# Altium project SW_balance.PrjPcb (part 1 of 2)
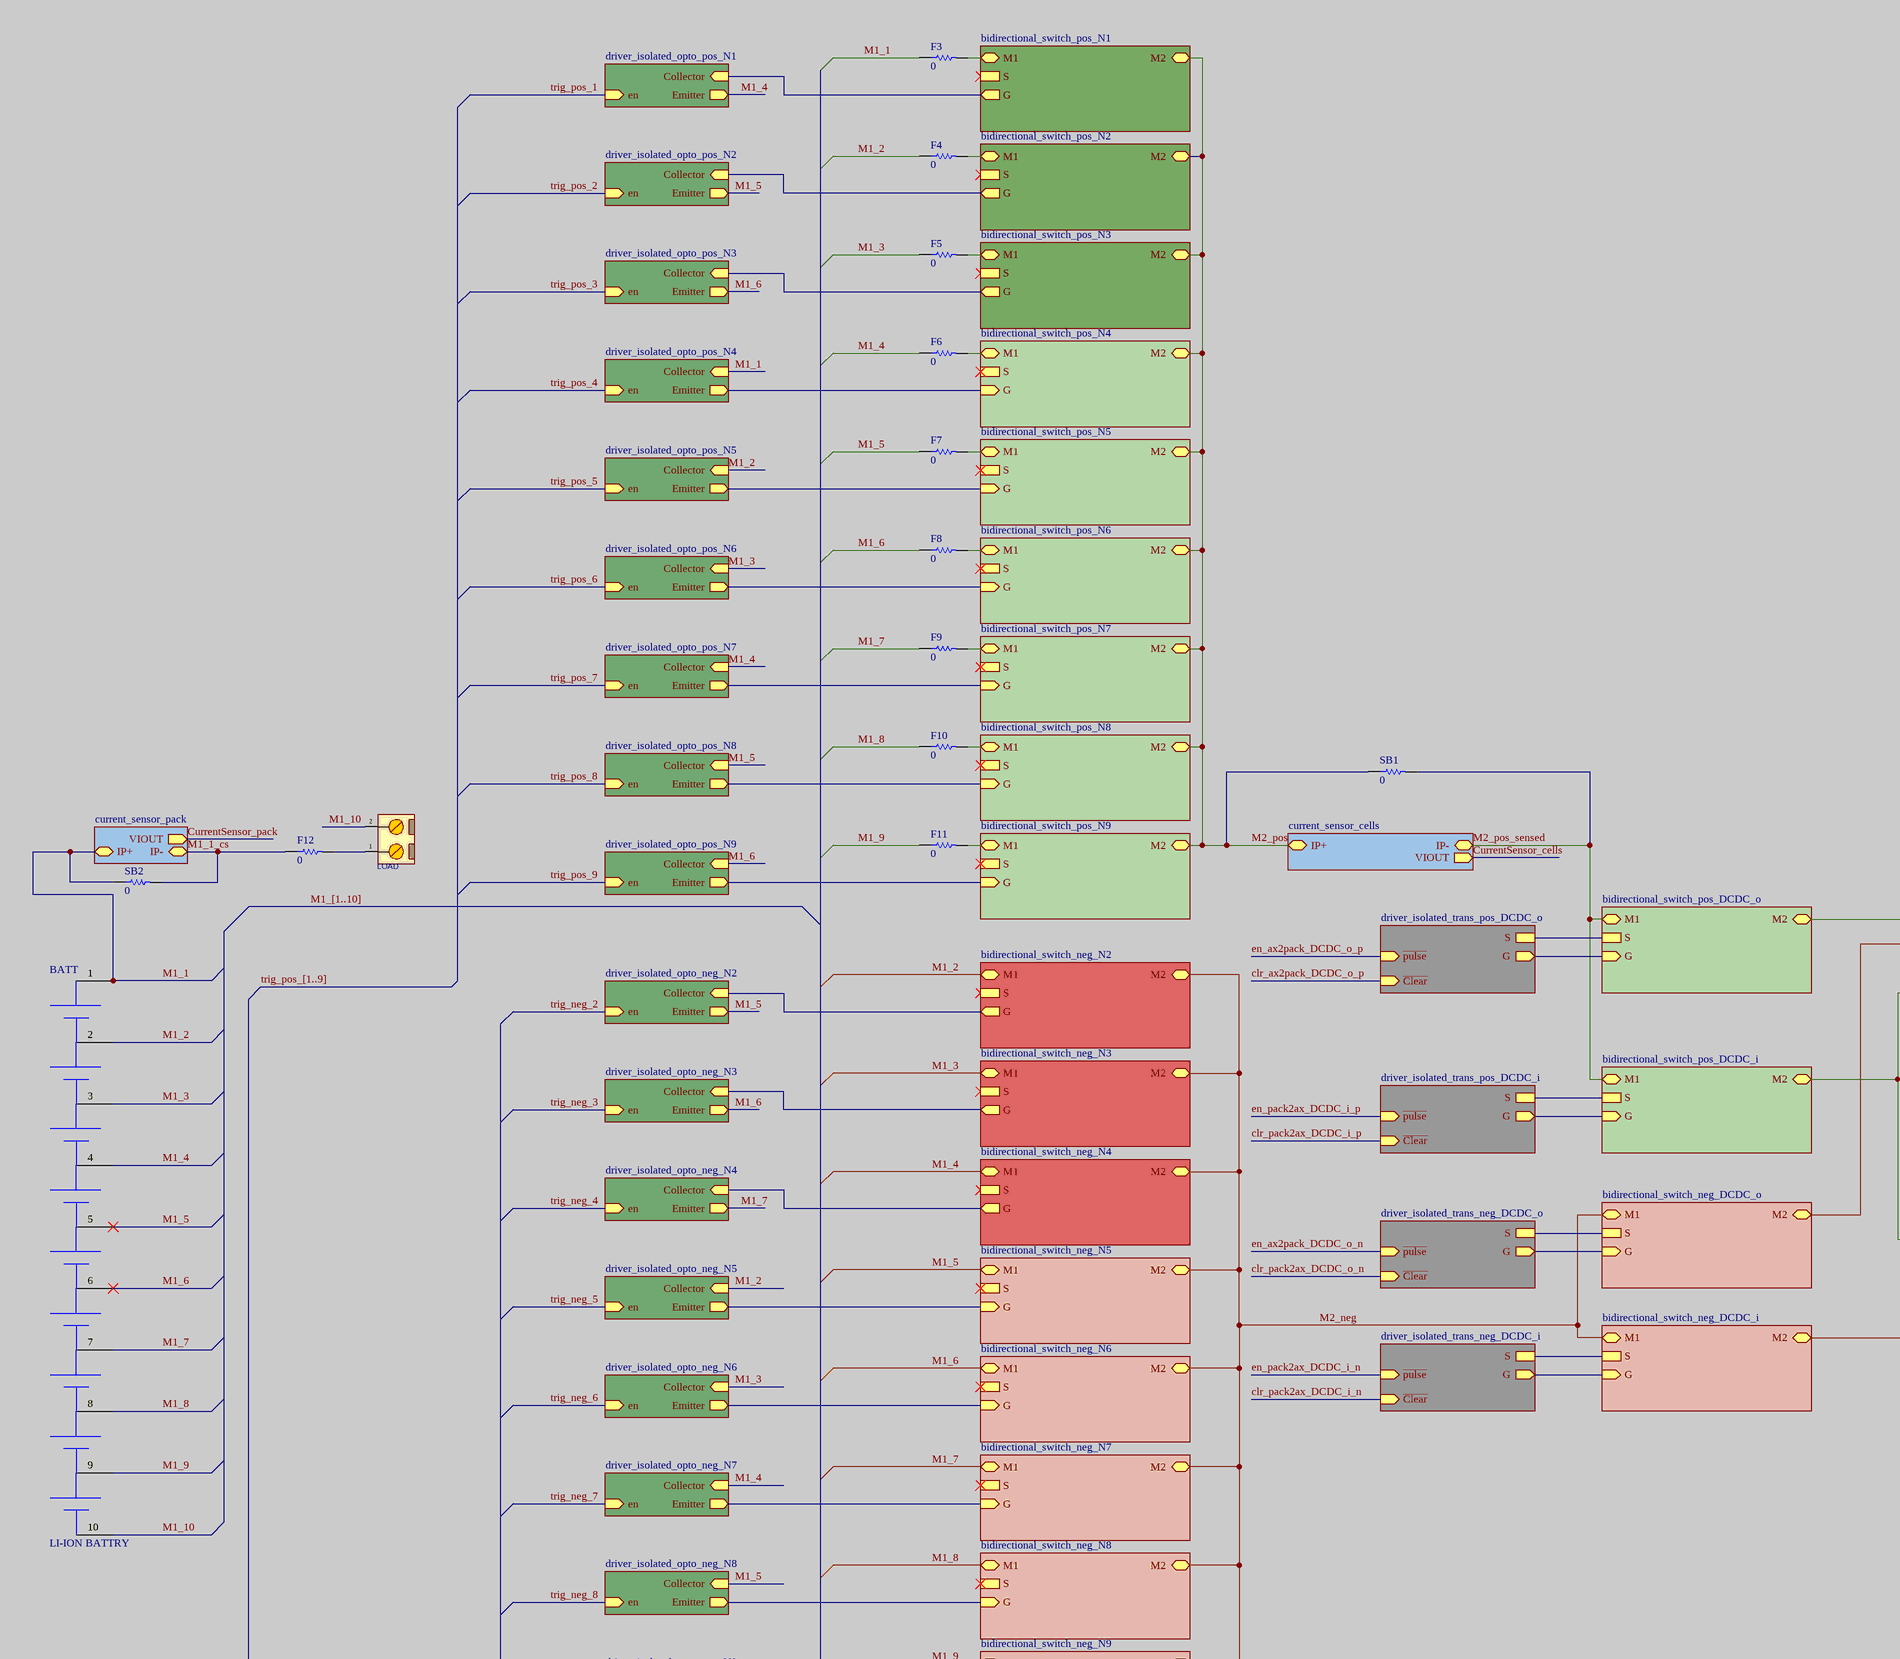
[diagram p0: main2020.SchDoc, top left]
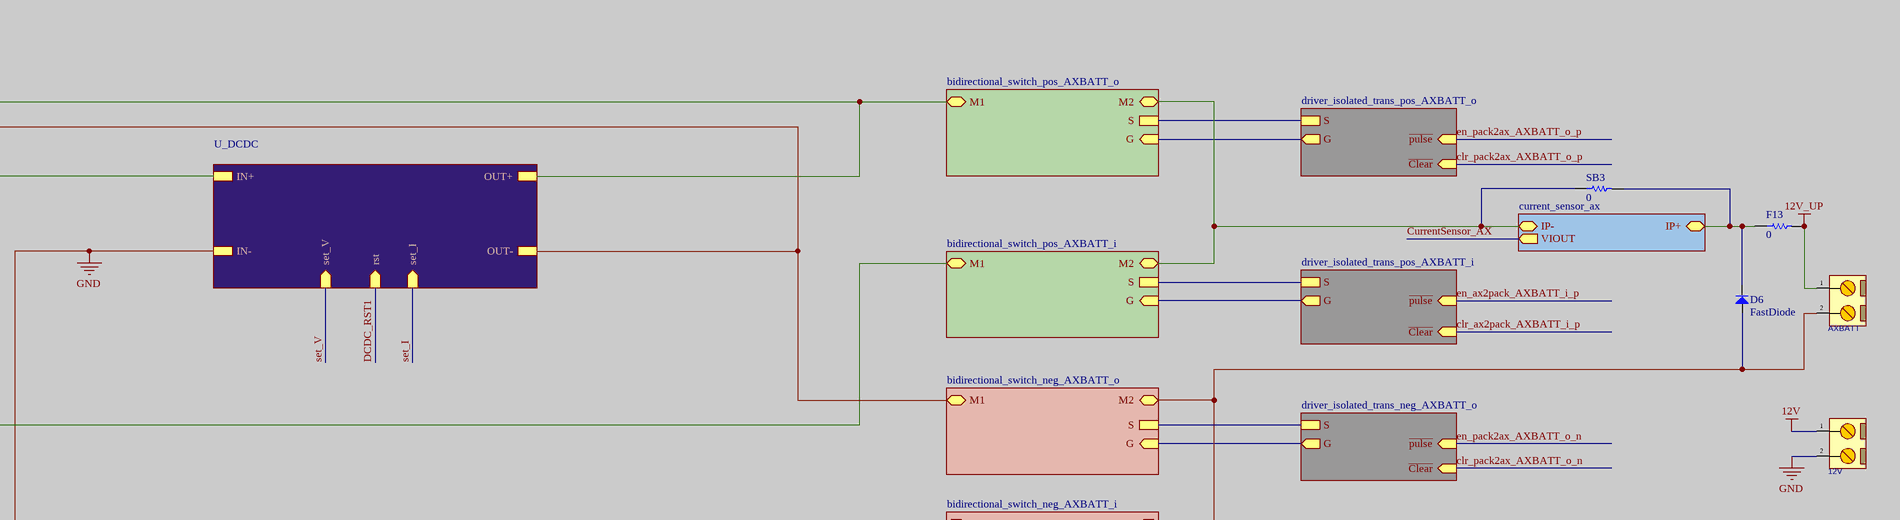
[diagram p1: main2020.SchDoc, top right]
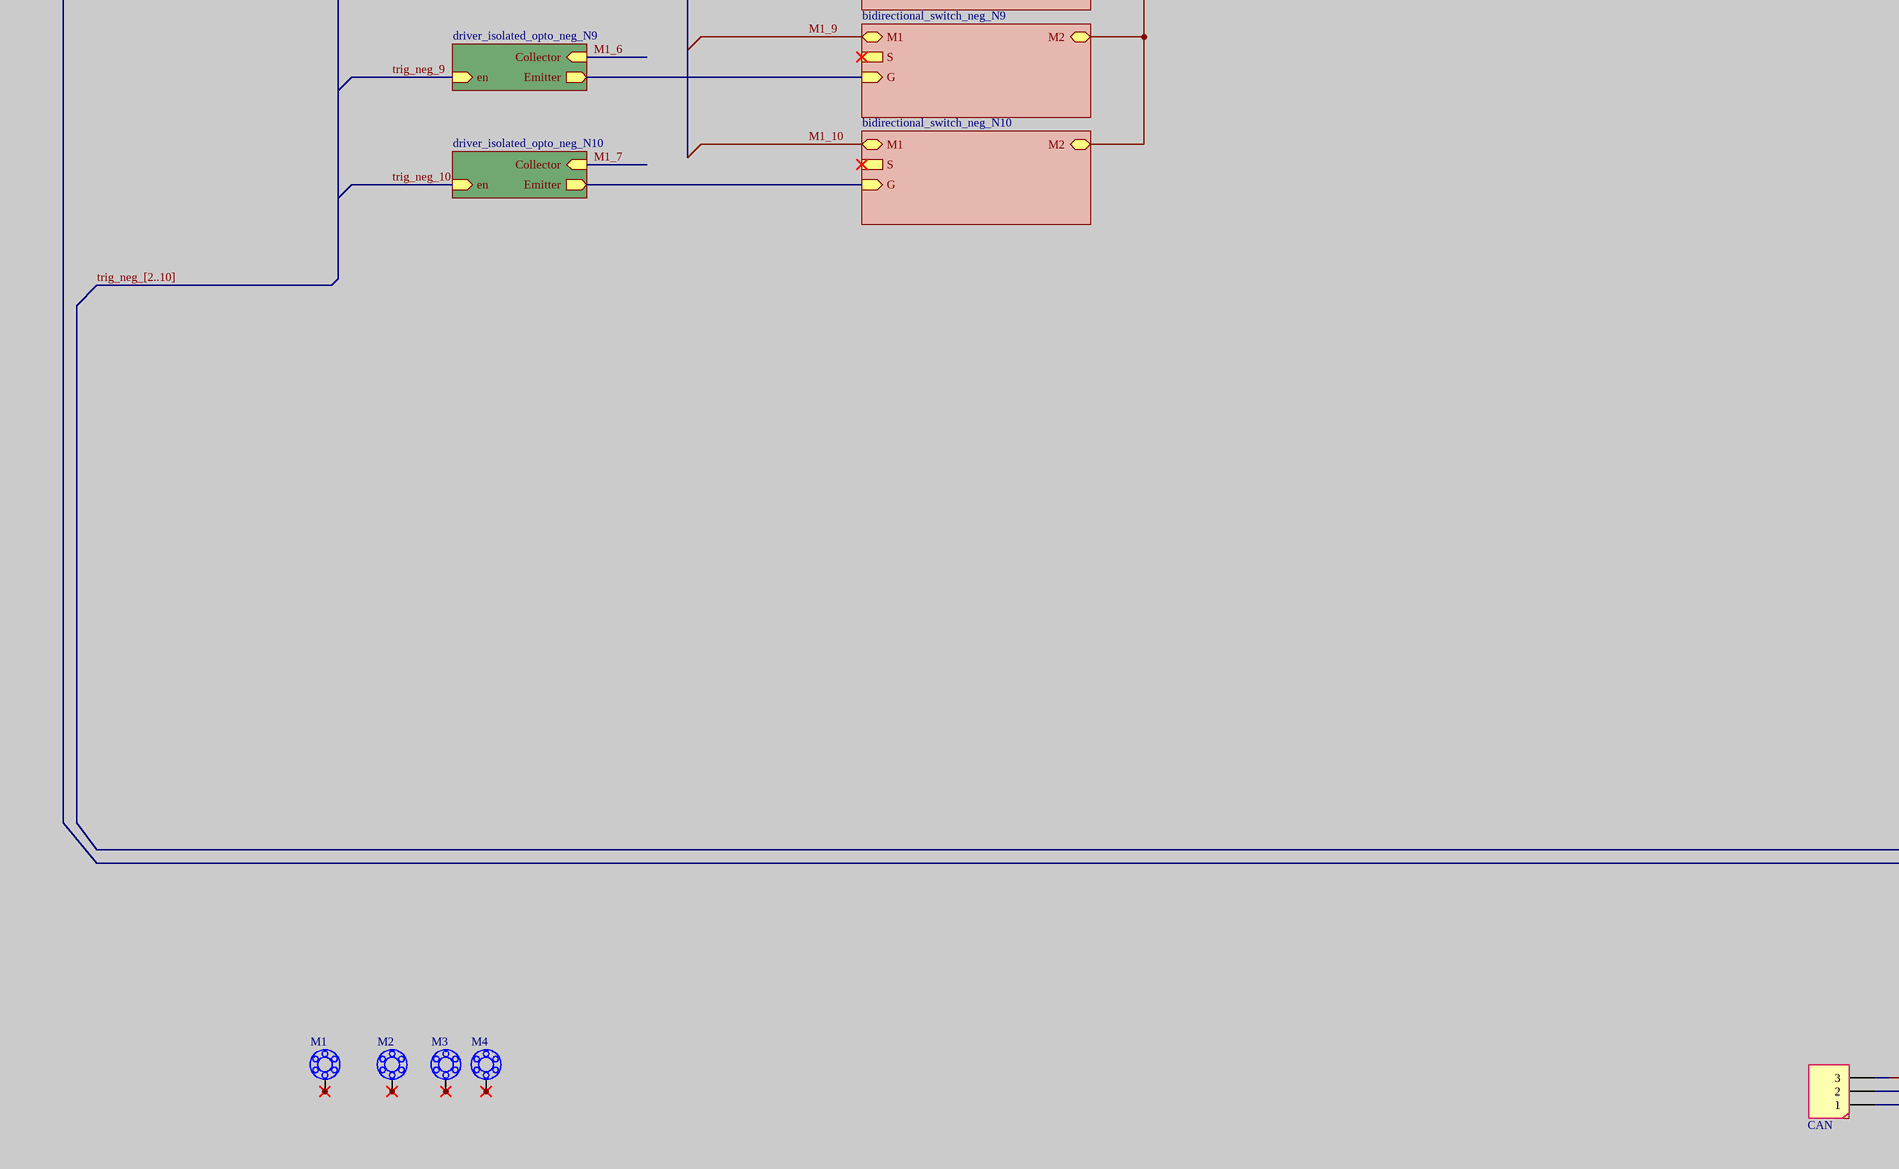
[diagram p2: main2020.SchDoc, bottom left]
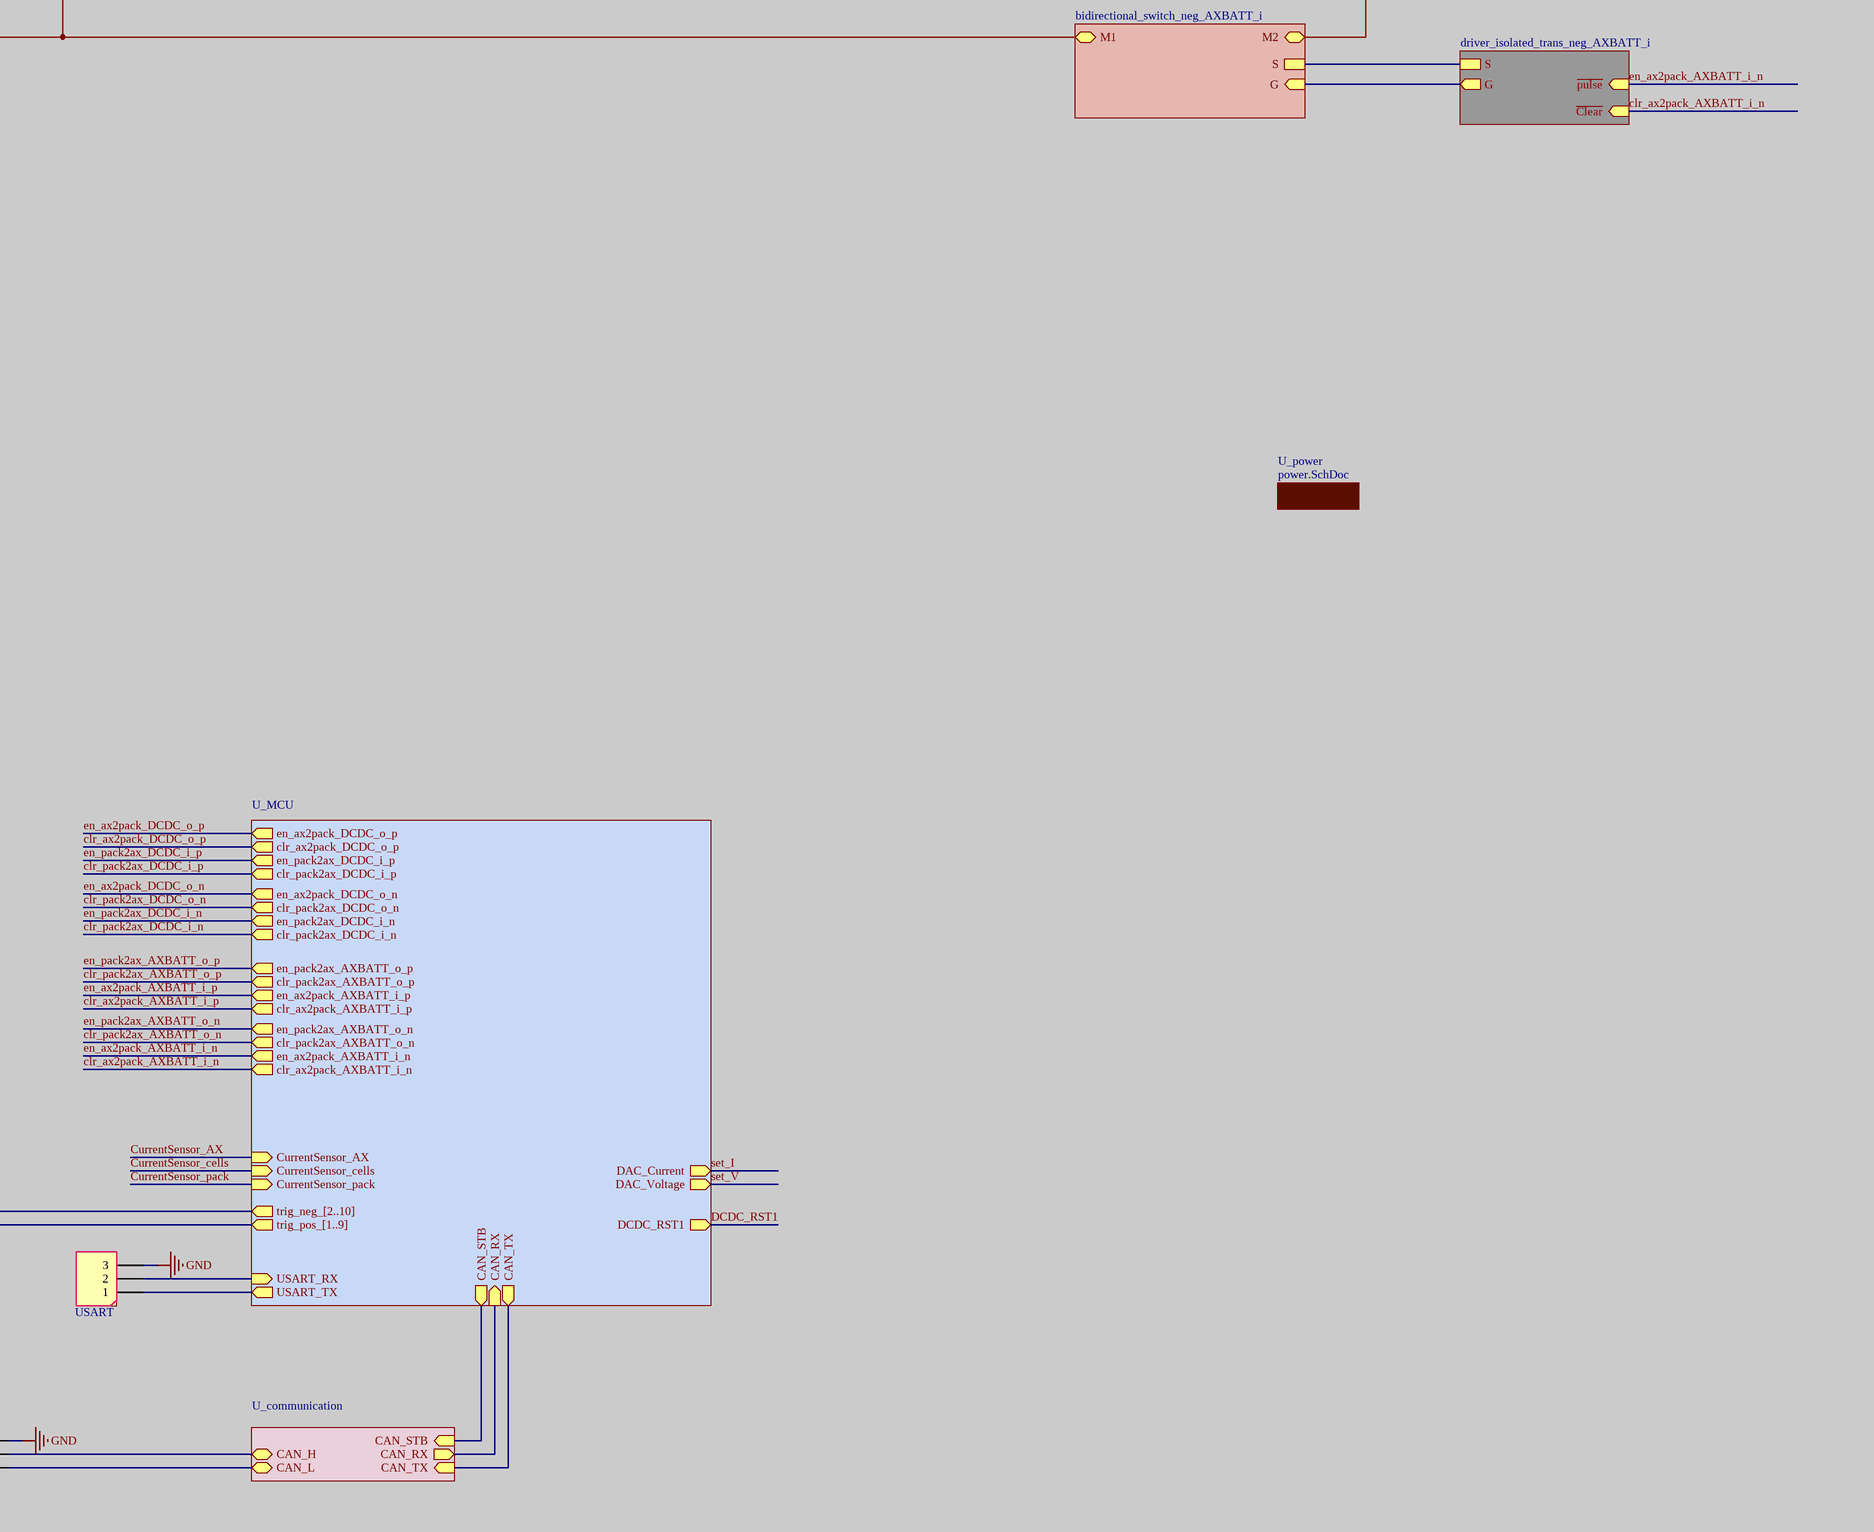
[diagram p3: main2020.SchDoc, bottom right]
10 sheets, 458 parts. Net scope: hierarchical (ports join the sheet entries above them; power ports are global).
Board file: balancer.PcbDoc
Sheets:
  main2020.SchDoc
    current_sensor_cells = current_sensor.SchDoc
    current_sensor_ax = current_sensor.SchDoc
    U_MCU = MCU.SchDoc
    U_DCDC = DCDC.SchDoc
    U_communication = communication.SchDoc
    U_power = power.SchDoc
    current_sensor_pack = current_sensor.SchDoc
    bidirectional_switch_pos_N4 = bidirectional_switch_N.SchDoc
    bidirectional_switch_pos_N5 = bidirectional_switch_N.SchDoc
    bidirectional_switch_pos_N6 = bidirectional_switch_N.SchDoc
    bidirectional_switch_pos_N7 = bidirectional_switch_N.SchDoc
    bidirectional_switch_pos_N8 = bidirectional_switch_N.SchDoc
    bidirectional_switch_pos_N9 = bidirectional_switch_N.SchDoc
    bidirectional_switch_neg_N5 = bidirectional_switch_N.SchDoc
    bidirectional_switch_neg_N6 = bidirectional_switch_N.SchDoc
    bidirectional_switch_neg_N7 = bidirectional_switch_N.SchDoc
    bidirectional_switch_neg_N8 = bidirectional_switch_N.SchDoc
    bidirectional_switch_neg_N9 = bidirectional_switch_N.SchDoc
    bidirectional_switch_neg_N10 = bidirectional_switch_N.SchDoc
    driver_isolated_opto_pos_N4 = driver_isolated_opto.SchDoc
    driver_isolated_opto_pos_N5 = driver_isolated_opto.SchDoc
    driver_isolated_opto_pos_N6 = driver_isolated_opto.SchDoc
    driver_isolated_opto_pos_N7 = driver_isolated_opto.SchDoc
    driver_isolated_opto_pos_N8 = driver_isolated_opto.SchDoc
    driver_isolated_opto_pos_N9 = driver_isolated_opto.SchDoc
    driver_isolated_opto_neg_N5 = driver_isolated_opto.SchDoc
    driver_isolated_opto_neg_N6 = driver_isolated_opto.SchDoc
    driver_isolated_opto_neg_N7 = driver_isolated_opto.SchDoc
    driver_isolated_opto_neg_N8 = driver_isolated_opto.SchDoc
    driver_isolated_opto_neg_N9 = driver_isolated_opto.SchDoc
    driver_isolated_opto_neg_N10 = driver_isolated_opto.SchDoc
    bidirectional_switch_pos_DCDC_o = bidirectional_switch_N.SchDoc
    driver_isolated_trans_pos_AXBATT_i = driver_isolated_trans.SchDoc
      opto_off = driver_isolated_opto.SchDoc
    bidirectional_switch_pos_AXBATT_i = bidirectional_switch_N.SchDoc
    driver_isolated_trans_pos_DCDC_i = driver_isolated_trans.SchDoc
      opto_off = driver_isolated_opto.SchDoc
    bidirectional_switch_pos_DCDC_i = bidirectional_switch_N.SchDoc
    driver_isolated_trans_pos_AXBATT_o = driver_isolated_trans.SchDoc
      opto_off = driver_isolated_opto.SchDoc
    bidirectional_switch_pos_AXBATT_o = bidirectional_switch_N.SchDoc
    driver_isolated_opto_pos_N3 = driver_isolated_opto.SchDoc
    driver_isolated_opto_pos_N2 = driver_isolated_opto.SchDoc
    driver_isolated_opto_pos_N1 = driver_isolated_opto.SchDoc
    bidirectional_switch_pos_N1 = bidirectional_switch.SchDoc
    bidirectional_switch_pos_N2 = bidirectional_switch.SchDoc
    bidirectional_switch_pos_N3 = bidirectional_switch.SchDoc
    driver_isolated_opto_neg_N4 = driver_isolated_opto.SchDoc
    driver_isolated_opto_neg_N3 = driver_isolated_opto.SchDoc
    driver_isolated_opto_neg_N2 = driver_isolated_opto.SchDoc
    bidirectional_switch_neg_N2 = bidirectional_switch.SchDoc
    bidirectional_switch_neg_N3 = bidirectional_switch.SchDoc
    bidirectional_switch_neg_N4 = bidirectional_switch.SchDoc
    bidirectional_switch_neg_DCDC_o = bidirectional_switch_N.SchDoc
    bidirectional_switch_neg_DCDC_i = bidirectional_switch_N.SchDoc
    driver_isolated_trans_neg_DCDC_o = driver_isolated_trans.SchDoc
      opto_off = driver_isolated_opto.SchDoc
    driver_isolated_trans_neg_DCDC_i = driver_isolated_trans.SchDoc
      opto_off = driver_isolated_opto.SchDoc
    bidirectional_switch_neg_AXBATT_o = bidirectional_switch_N.SchDoc
    bidirectional_switch_neg_AXBATT_i = bidirectional_switch_N.SchDoc
    driver_isolated_trans_neg_AXBATT_o = driver_isolated_trans.SchDoc
      opto_off = driver_isolated_opto.SchDoc
    driver_isolated_trans_neg_AXBATT_i = driver_isolated_trans.SchDoc
      opto_off = driver_isolated_opto.SchDoc
    driver_isolated_trans_pos_DCDC_o = driver_isolated_trans.SchDoc
      opto_off = driver_isolated_opto.SchDoc

## Sheet main2020.SchDoc
size A1

### Parts
12V  CONN_TB8  [terminal block - 2828372]  (value not drawn)
AXBATT  CONN_TB8  [terminal block - 2828372]  (value not drawn)
BATT  LI-ION BATTRY  [terminal block - battery - 2828372 -]
CAN  DCDC_CTRL  [HEADER1*3]  (value not drawn)
D6  FastDiode  [FastDiode]
F3  0  [RESC0603]
F4  0  [RESC0603]
F5  0  [RESC0603]
F6  0  [RESC0603]
F7  0  [RESC0603]
F8  0  [RESC0603]
F9  0  [RESC0603]
F10  0  [RESC0603]
F11  0  [RESC0603]
F12  0  [RESC0603]
F13  0  [RESC0603]
LOAD  CONN_TB8  [terminal block - 2828372]  (value not drawn)
M1  M  [MOUNTING]  (value not drawn)  (no BOM)
M2  M  [MOUNTING]  (value not drawn)  (no BOM)
M3  M  [MOUNTING]  (value not drawn)  (no BOM)
M4  M  [MOUNTING]  (value not drawn)  (no BOM)
SB1  0  [RESC0603]
SB2  0  [RESC0603]
SB3  0  [RESC0603]
USART  DCDC_CTRL  [HEADER1*3]  (value not drawn)

### Sub-sheets
bidirectional_switch_neg_AXBATT_i = bidirectional_switch_N.SchDoc: M1 (bidir), M2 (bidir), G (in), S
bidirectional_switch_neg_AXBATT_o = bidirectional_switch_N.SchDoc: M1 (bidir), M2 (bidir), G (in), S
bidirectional_switch_neg_DCDC_i = bidirectional_switch_N.SchDoc: M1 (bidir), M2 (bidir), G (in), S
bidirectional_switch_neg_DCDC_o = bidirectional_switch_N.SchDoc: M1 (bidir), M2 (bidir), G (in), S
bidirectional_switch_neg_N2 = bidirectional_switch.SchDoc: M1 (bidir), M2 (bidir), S, G (out)
bidirectional_switch_neg_N3 = bidirectional_switch.SchDoc: M1 (bidir), M2 (bidir), S, G (out)
bidirectional_switch_neg_N4 = bidirectional_switch.SchDoc: M1 (bidir), M2 (bidir), S, G (out)
bidirectional_switch_neg_N5 = bidirectional_switch_N.SchDoc: M1 (bidir), M2 (bidir), G (in), S
bidirectional_switch_neg_N6 = bidirectional_switch_N.SchDoc: M1 (bidir), M2 (bidir), G (in), S
bidirectional_switch_neg_N7 = bidirectional_switch_N.SchDoc: M1 (bidir), M2 (bidir), G (in), S
bidirectional_switch_neg_N8 = bidirectional_switch_N.SchDoc: M1 (bidir), M2 (bidir), G (in), S
bidirectional_switch_neg_N9 = bidirectional_switch_N.SchDoc: M1 (bidir), M2 (bidir), G (in), S
bidirectional_switch_neg_N10 = bidirectional_switch_N.SchDoc: M1 (bidir), M2 (bidir), G (in), S
bidirectional_switch_pos_AXBATT_i = bidirectional_switch_N.SchDoc: M1 (bidir), M2 (bidir), G (in), S
bidirectional_switch_pos_AXBATT_o = bidirectional_switch_N.SchDoc: M1 (bidir), M2 (bidir), G (in), S
bidirectional_switch_pos_DCDC_i = bidirectional_switch_N.SchDoc: M1 (bidir), M2 (bidir), G (in), S
bidirectional_switch_pos_DCDC_o = bidirectional_switch_N.SchDoc: M1 (bidir), M2 (bidir), G (in), S
bidirectional_switch_pos_N1 = bidirectional_switch.SchDoc: M1 (bidir), M2 (bidir), S, G (out)
bidirectional_switch_pos_N2 = bidirectional_switch.SchDoc: M1 (bidir), M2 (bidir), S, G (out)
bidirectional_switch_pos_N3 = bidirectional_switch.SchDoc: M1 (bidir), M2 (bidir), S, G (out)
bidirectional_switch_pos_N4 = bidirectional_switch_N.SchDoc: M1 (bidir), M2 (bidir), G (in), S
bidirectional_switch_pos_N5 = bidirectional_switch_N.SchDoc: M1 (bidir), M2 (bidir), G (in), S
bidirectional_switch_pos_N6 = bidirectional_switch_N.SchDoc: M1 (bidir), M2 (bidir), G (in), S
bidirectional_switch_pos_N7 = bidirectional_switch_N.SchDoc: M1 (bidir), M2 (bidir), G (in), S
bidirectional_switch_pos_N8 = bidirectional_switch_N.SchDoc: M1 (bidir), M2 (bidir), G (in), S
bidirectional_switch_pos_N9 = bidirectional_switch_N.SchDoc: M1 (bidir), M2 (bidir), G (in), S
current_sensor_ax = current_sensor.SchDoc: IP+ (bidir), IP- (bidir), VIOUT (out)
current_sensor_cells = current_sensor.SchDoc: IP+ (bidir), IP- (bidir), VIOUT (out)
current_sensor_pack = current_sensor.SchDoc: IP+ (bidir), IP- (bidir), VIOUT (out)
driver_isolated_opto_neg_N2 = driver_isolated_opto.SchDoc: en (in), Emitter (out), Collector (in)
driver_isolated_opto_neg_N3 = driver_isolated_opto.SchDoc: en (in), Emitter (out), Collector (in)
driver_isolated_opto_neg_N4 = driver_isolated_opto.SchDoc: en (in), Emitter (out), Collector (in)
driver_isolated_opto_neg_N5 = driver_isolated_opto.SchDoc: en (in), Emitter (out), Collector (in)
driver_isolated_opto_neg_N6 = driver_isolated_opto.SchDoc: en (in), Emitter (out), Collector (in)
driver_isolated_opto_neg_N7 = driver_isolated_opto.SchDoc: en (in), Emitter (out), Collector (in)
driver_isolated_opto_neg_N8 = driver_isolated_opto.SchDoc: en (in), Emitter (out), Collector (in)
driver_isolated_opto_neg_N9 = driver_isolated_opto.SchDoc: en (in), Emitter (out), Collector (in)
driver_isolated_opto_neg_N10 = driver_isolated_opto.SchDoc: en (in), Emitter (out), Collector (in)
driver_isolated_opto_pos_N1 = driver_isolated_opto.SchDoc: en (in), Emitter (out), Collector (in)
driver_isolated_opto_pos_N2 = driver_isolated_opto.SchDoc: en (in), Emitter (out), Collector (in)
driver_isolated_opto_pos_N3 = driver_isolated_opto.SchDoc: en (in), Emitter (out), Collector (in)
driver_isolated_opto_pos_N4 = driver_isolated_opto.SchDoc: en (in), Emitter (out), Collector (in)
driver_isolated_opto_pos_N5 = driver_isolated_opto.SchDoc: en (in), Emitter (out), Collector (in)
driver_isolated_opto_pos_N6 = driver_isolated_opto.SchDoc: en (in), Emitter (out), Collector (in)
driver_isolated_opto_pos_N7 = driver_isolated_opto.SchDoc: en (in), Emitter (out), Collector (in)
driver_isolated_opto_pos_N8 = driver_isolated_opto.SchDoc: en (in), Emitter (out), Collector (in)
driver_isolated_opto_pos_N9 = driver_isolated_opto.SchDoc: en (in), Emitter (out), Collector (in)
driver_isolated_trans_neg_AXBATT_i = driver_isolated_trans.SchDoc: ~{pulse} (in), G (out), S, ~{Clear} (in)
driver_isolated_trans_neg_AXBATT_o = driver_isolated_trans.SchDoc: ~{pulse} (in), G (out), S, ~{Clear} (in)
driver_isolated_trans_neg_DCDC_i = driver_isolated_trans.SchDoc: ~{pulse} (in), G (out), S, ~{Clear} (in)
driver_isolated_trans_neg_DCDC_o = driver_isolated_trans.SchDoc: ~{pulse} (in), G (out), S, ~{Clear} (in)
driver_isolated_trans_pos_AXBATT_i = driver_isolated_trans.SchDoc: ~{pulse} (in), G (out), S, ~{Clear} (in)
driver_isolated_trans_pos_AXBATT_o = driver_isolated_trans.SchDoc: ~{pulse} (in), G (out), S, ~{Clear} (in)
driver_isolated_trans_pos_DCDC_i = driver_isolated_trans.SchDoc: ~{pulse} (in), G (out), S, ~{Clear} (in)
driver_isolated_trans_pos_DCDC_o = driver_isolated_trans.SchDoc: ~{pulse} (in), G (out), S, ~{Clear} (in)
U_communication = communication.SchDoc: CAN_TX (in), CAN_RX (out), CAN_H (bidir), CAN_L (bidir), CAN_STB (in)
U_DCDC = DCDC.SchDoc: IN+, IN-, OUT+, OUT-, set_V (in), set_I (in), rst (in)
U_MCU = MCU.SchDoc: DAC_Current (out), DAC_Voltage (out), USART_TX (out), USART_RX (in), DCDC_RST1 (out), CAN_TX (out), CAN_RX (in), CAN_STB (out), trig_pos_[1..9] (out), trig_neg_[2..10] (out), CurrentSensor_AX (in), CurrentSensor_cells (in), CurrentSensor_pack (in), en_ax2pack_DCDC_o_p (out), clr_ax2pack_DCDC_o_p (out), en_pack2ax_DCDC_i_p (out), clr_pack2ax_DCDC_i_p (out), en_ax2pack_DCDC_o_n (out), clr_pack2ax_DCDC_o_n (out), en_pack2ax_DCDC_i_n (out), clr_pack2ax_DCDC_i_n (out), en_pack2ax_AXBATT_o_p (out), clr_pack2ax_AXBATT_o_p (out), en_ax2pack_AXBATT_i_p (out), clr_ax2pack_AXBATT_i_p (out), en_pack2ax_AXBATT_o_n (out), clr_pack2ax_AXBATT_o_n (out), en_ax2pack_AXBATT_i_n (out), clr_ax2pack_AXBATT_i_n (out)
U_power = power.SchDoc: no entries

### Nets
12V: 12V.1
12V_UP: AXBATT.1 F13.2
CAN_N: CAN.2 ; sheet U_communication/CAN_H
CAN_P: CAN.1 ; sheet U_communication/CAN_L
GND: 12V.2 CAN.3 USART.3 ; sheet U_DCDC/IN-, sheet bidirectional_switch_neg_DCDC_i/M2, sheet bidirectional_switch_neg_AXBATT_i/M1
CAN_RX: sheet U_MCU/CAN_RX, sheet U_communication/CAN_RX
CAN_STB: sheet U_MCU/CAN_STB, sheet U_communication/CAN_STB
CAN_TX: sheet U_MCU/CAN_TX, sheet U_communication/CAN_TX
clr_ax2pack_AXBATT_i_n: sheet U_MCU/clr_ax2pack_AXBATT_i_n, sheet driver_isolated_trans_neg_AXBATT_i/~{Clear}
clr_ax2pack_AXBATT_i_p: sheet U_MCU/clr_ax2pack_AXBATT_i_p, sheet driver_isolated_trans_pos_AXBATT_i/~{Clear}
clr_ax2pack_DCDC_o_p: sheet U_MCU/clr_ax2pack_DCDC_o_p, sheet driver_isolated_trans_pos_DCDC_o/~{Clear}
clr_pack2ax_AXBATT_o_n: sheet U_MCU/clr_pack2ax_AXBATT_o_n, sheet driver_isolated_trans_neg_AXBATT_o/~{Clear}
clr_pack2ax_AXBATT_o_p: sheet U_MCU/clr_pack2ax_AXBATT_o_p, sheet driver_isolated_trans_pos_AXBATT_o/~{Clear}
clr_pack2ax_DCDC_i_n: sheet U_MCU/clr_pack2ax_DCDC_i_n, sheet driver_isolated_trans_neg_DCDC_i/~{Clear}
clr_pack2ax_DCDC_i_p: sheet U_MCU/clr_pack2ax_DCDC_i_p, sheet driver_isolated_trans_pos_DCDC_i/~{Clear}
clr_pack2ax_DCDC_o_n: sheet U_MCU/clr_pack2ax_DCDC_o_n, sheet driver_isolated_trans_neg_DCDC_o/~{Clear}
CurrentSensor_AX: sheet current_sensor_ax/VIOUT, sheet U_MCU/CurrentSensor_AX
CurrentSensor_cells: sheet current_sensor_cells/VIOUT, sheet U_MCU/CurrentSensor_cells
CurrentSensor_pack: sheet U_MCU/CurrentSensor_pack, sheet current_sensor_pack/VIOUT
DCDC_RST1: sheet U_MCU/DCDC_RST1, sheet U_DCDC/rst
en_ax2pack_AXBATT_i_n: sheet U_MCU/en_ax2pack_AXBATT_i_n, sheet driver_isolated_trans_neg_AXBATT_i/~{pulse}
en_ax2pack_AXBATT_i_p: sheet U_MCU/en_ax2pack_AXBATT_i_p, sheet driver_isolated_trans_pos_AXBATT_i/~{pulse}
en_ax2pack_DCDC_o_n: sheet U_MCU/en_ax2pack_DCDC_o_n, sheet driver_isolated_trans_neg_DCDC_o/~{pulse}
en_ax2pack_DCDC_o_p: sheet U_MCU/en_ax2pack_DCDC_o_p, sheet driver_isolated_trans_pos_DCDC_o/~{pulse}
en_pack2ax_AXBATT_o_n: sheet U_MCU/en_pack2ax_AXBATT_o_n, sheet driver_isolated_trans_neg_AXBATT_o/~{pulse}
en_pack2ax_AXBATT_o_p: sheet U_MCU/en_pack2ax_AXBATT_o_p, sheet driver_isolated_trans_pos_AXBATT_o/~{pulse}
en_pack2ax_DCDC_i_n: sheet U_MCU/en_pack2ax_DCDC_i_n, sheet driver_isolated_trans_neg_DCDC_i/~{pulse}
en_pack2ax_DCDC_i_p: sheet U_MCU/en_pack2ax_DCDC_i_p, sheet driver_isolated_trans_pos_DCDC_i/~{pulse}
M1_1: BATT.1 F3.1 SB2.1 ; sheet current_sensor_pack/IP+, sheet driver_isolated_opto_pos_N4/Collector
M1_1_cs: F12.1 SB2.2 ; sheet current_sensor_pack/IP-
M1_2: BATT.2 F4.1 ; sheet driver_isolated_opto_pos_N5/Collector, sheet driver_isolated_opto_neg_N5/Collector, sheet bidirectional_switch_neg_N2/M1
M1_3: BATT.3 F5.1 ; sheet driver_isolated_opto_pos_N6/Collector, sheet driver_isolated_opto_neg_N6/Collector, sheet bidirectional_switch_neg_N3/M1
M1_4: BATT.4 F6.1 ; sheet driver_isolated_opto_pos_N7/Collector, sheet driver_isolated_opto_neg_N7/Collector, sheet driver_isolated_opto_pos_N1/Emitter, sheet bidirectional_switch_neg_N4/M1
M1_5: BATT.5 F7.1 ; sheet bidirectional_switch_neg_N5/M1, sheet driver_isolated_opto_pos_N8/Collector, sheet driver_isolated_opto_neg_N8/Collector, sheet driver_isolated_opto_pos_N2/Emitter, sheet driver_isolated_opto_neg_N2/Emitter
M1_6: BATT.6 F8.1 ; sheet bidirectional_switch_neg_N6/M1, sheet driver_isolated_opto_pos_N9/Collector, sheet driver_isolated_opto_neg_N9/Collector, sheet driver_isolated_opto_pos_N3/Emitter, sheet driver_isolated_opto_neg_N3/Emitter
M1_7: BATT.7 F9.1 ; sheet bidirectional_switch_neg_N7/M1, sheet driver_isolated_opto_neg_N10/Collector, sheet driver_isolated_opto_neg_N4/Emitter
M1_8: BATT.8 F10.1 ; sheet bidirectional_switch_neg_N8/M1
M1_9: BATT.9 F11.1 ; sheet bidirectional_switch_neg_N9/M1
M1_10: BATT.10 LOAD.2 ; sheet bidirectional_switch_neg_N10/M1
M2_neg: sheet bidirectional_switch_neg_N5/M2, sheet bidirectional_switch_neg_N6/M2, sheet bidirectional_switch_neg_N7/M2, sheet bidirectional_switch_neg_N8/M2, sheet bidirectional_switch_neg_N9/M2, sheet bidirectional_switch_neg_N10/M2, sheet bidirectional_switch_neg_N2/M2, sheet bidirectional_switch_neg_N3/M2, sheet bidirectional_switch_neg_N4/M2, sheet bidirectional_switch_neg_DCDC_o/M1, sheet bidirectional_switch_neg_DCDC_i/M1
M2_pos: SB1.1 ; sheet current_sensor_cells/IP+, sheet bidirectional_switch_pos_N4/M2, sheet bidirectional_switch_pos_N5/M2, sheet bidirectional_switch_pos_N6/M2, sheet bidirectional_switch_pos_N7/M2, sheet bidirectional_switch_pos_N8/M2, sheet bidirectional_switch_pos_N9/M2, sheet bidirectional_switch_pos_N1/M2, sheet bidirectional_switch_pos_N2/M2, sheet bidirectional_switch_pos_N3/M2
M2_pos_sensed: SB1.2 ; sheet current_sensor_cells/IP-, sheet bidirectional_switch_pos_DCDC_o/M1, sheet bidirectional_switch_pos_DCDC_i/M1
set_I: sheet U_MCU/DAC_Current, sheet U_DCDC/set_I  [project net DAC_Current]
set_V: sheet U_MCU/DAC_Voltage, sheet U_DCDC/set_V  [project net DAC_Voltage]
USART_RX: USART.2 ; sheet U_MCU/USART_RX
USART_TX: USART.1 ; sheet U_MCU/USART_TX
NetAXBATT_2: AXBATT.2 D6.1(A) ; sheet bidirectional_switch_neg_AXBATT_o/M2, sheet bidirectional_switch_neg_AXBATT_i/M2
NetD3M_1: sheet bidirectional_switch_pos_DCDC_o/S, sheet driver_isolated_trans_pos_DCDC_o/S
NetD3N_1: sheet driver_isolated_trans_pos_AXBATT_i/S, sheet bidirectional_switch_pos_AXBATT_i/S
NetD3O_1: sheet driver_isolated_trans_pos_DCDC_i/S, sheet bidirectional_switch_pos_DCDC_i/S
NetD3P_1: sheet driver_isolated_trans_pos_AXBATT_o/S, sheet bidirectional_switch_pos_AXBATT_o/S
NetD3Q_1: sheet bidirectional_switch_neg_DCDC_o/S, sheet driver_isolated_trans_neg_DCDC_o/S
NetD3R_1: sheet bidirectional_switch_neg_DCDC_i/S, sheet driver_isolated_trans_neg_DCDC_i/S
NetD3S_1: sheet bidirectional_switch_neg_AXBATT_o/S, sheet driver_isolated_trans_neg_AXBATT_o/S
NetD3T_1: sheet bidirectional_switch_neg_AXBATT_i/S, sheet driver_isolated_trans_neg_AXBATT_i/S
NetD4_1: sheet U_DCDC/OUT-, sheet bidirectional_switch_neg_DCDC_o/M2, sheet bidirectional_switch_neg_AXBATT_o/M1
NetD4_2: sheet U_DCDC/OUT+, sheet bidirectional_switch_pos_DCDC_o/M2, sheet bidirectional_switch_pos_AXBATT_o/M1
NetD5_2: sheet U_DCDC/IN+, sheet bidirectional_switch_pos_AXBATT_i/M1, sheet bidirectional_switch_pos_DCDC_i/M2
NetD6_2: D6.2(K) F13.1 SB3.2 ; sheet current_sensor_ax/IP+
NetF3_2: F3.2 ; sheet bidirectional_switch_pos_N1/M1
NetF4_2: F4.2 ; sheet bidirectional_switch_pos_N2/M1
NetF5_2: F5.2 ; sheet bidirectional_switch_pos_N3/M1
NetF6_2: F6.2 ; sheet bidirectional_switch_pos_N4/M1
NetF7_2: F7.2 ; sheet bidirectional_switch_pos_N5/M1
NetF8_2: F8.2 ; sheet bidirectional_switch_pos_N6/M1
NetF9_2: F9.2 ; sheet bidirectional_switch_pos_N7/M1
NetF10_2: F10.2 ; sheet bidirectional_switch_pos_N8/M1
NetF11_2: F11.2 ; sheet bidirectional_switch_pos_N9/M1
NetF12_2: F12.2 LOAD.1
NetM1_1: M1.1 M1.2 M1.3 M1.4 M1.5 M1.6 M1.7
NetM2_1: M2.1 M2.2 M2.3 M2.4 M2.5 M2.6 M2.7
NetM3_1: M3.1 M3.2 M3.3 M3.4 M3.5 M3.6 M3.7
NetM4_1: M4.1 M4.2 M4.3 M4.4 M4.5 M4.6 M4.7
NetQ4N_2: SB3.1 ; sheet current_sensor_ax/IP-, sheet bidirectional_switch_pos_AXBATT_i/M2, sheet bidirectional_switch_pos_AXBATT_o/M2
NetR20A_1: sheet driver_isolated_trans_pos_AXBATT_i/G, sheet bidirectional_switch_pos_AXBATT_i/G
NetR20B_1: sheet driver_isolated_trans_pos_DCDC_i/G, sheet bidirectional_switch_pos_DCDC_i/G
NetR20C_1: sheet driver_isolated_trans_pos_AXBATT_o/G, sheet bidirectional_switch_pos_AXBATT_o/G
NetR20D_1: sheet bidirectional_switch_neg_DCDC_o/G, sheet driver_isolated_trans_neg_DCDC_o/G
NetR20E_1: sheet bidirectional_switch_neg_DCDC_i/G, sheet driver_isolated_trans_neg_DCDC_i/G
NetR20F_1: sheet bidirectional_switch_neg_AXBATT_o/G, sheet driver_isolated_trans_neg_AXBATT_o/G
NetR20G_1: sheet bidirectional_switch_neg_AXBATT_i/G, sheet driver_isolated_trans_neg_AXBATT_i/G
NetR20H_1: sheet bidirectional_switch_pos_DCDC_o/G, sheet driver_isolated_trans_pos_DCDC_o/G
NetR25A_1: sheet bidirectional_switch_pos_N4/G, sheet driver_isolated_opto_pos_N4/Emitter
NetR25B_1: sheet bidirectional_switch_pos_N5/G, sheet driver_isolated_opto_pos_N5/Emitter
NetR25C_1: sheet bidirectional_switch_pos_N6/G, sheet driver_isolated_opto_pos_N6/Emitter
NetR25D_1: sheet bidirectional_switch_pos_N7/G, sheet driver_isolated_opto_pos_N7/Emitter
NetR25E_1: sheet bidirectional_switch_pos_N8/G, sheet driver_isolated_opto_pos_N8/Emitter
NetR25F_1: sheet bidirectional_switch_pos_N9/G, sheet driver_isolated_opto_pos_N9/Emitter
NetR25G_1: sheet bidirectional_switch_neg_N5/G, sheet driver_isolated_opto_neg_N5/Emitter
NetR25H_1: sheet bidirectional_switch_neg_N6/G, sheet driver_isolated_opto_neg_N6/Emitter
NetR25I_1: sheet bidirectional_switch_neg_N7/G, sheet driver_isolated_opto_neg_N7/Emitter
NetR25J_1: sheet bidirectional_switch_neg_N8/G, sheet driver_isolated_opto_neg_N8/Emitter
NetR25K_1: sheet bidirectional_switch_neg_N9/G, sheet driver_isolated_opto_neg_N9/Emitter
NetR25L_1: sheet bidirectional_switch_neg_N10/G, sheet driver_isolated_opto_neg_N10/Emitter
NetR26A_1: sheet driver_isolated_opto_pos_N1/Collector, sheet bidirectional_switch_pos_N1/G
NetR26B_1: sheet driver_isolated_opto_pos_N2/Collector, sheet bidirectional_switch_pos_N2/G
NetR26C_1: sheet driver_isolated_opto_pos_N3/Collector, sheet bidirectional_switch_pos_N3/G
NetR26D_1: sheet driver_isolated_opto_neg_N2/Collector, sheet bidirectional_switch_neg_N2/G
NetR26E_1: sheet driver_isolated_opto_neg_N3/Collector, sheet bidirectional_switch_neg_N3/G
NetR26F_1: sheet driver_isolated_opto_neg_N4/Collector, sheet bidirectional_switch_neg_N4/G

### Buses and harness runs
bus M1_[1..10]
bus trig_neg_[2..10] = sheet U_MCU/trig_neg_[2..10]
bus trig_pos_[1..9] = sheet U_MCU/trig_pos_[1..9]

### Library data of the parts
12V AXBATT LOAD = TERMINAL_BLOCK 1 × 2: CONN, TERMINAL BLOCK, 5.08mm pitch; VALUE: CONN_TB8
BATT = BATTRY_pack
CAN USART = Header1*3: Header, 3-Pin; LatestRevisionDate: 17-Jul-2002; LatestRevisionNote: Re-released for DXP Platform.; Publisher: Altium Limited
F3-F13 SB1-SB3 = Resistor: 0603,0.1W; Published: 8-Jun-2000; LatestRevisionDate: 17-Jul-2002; LatestRevisionNote: Re-released for DXP Platform.; PackageReference: AXIAL-0.5; Publisher: Altium Limited; Value: 0
M1-M4 = MOUNTING
D6 = FastDiode: Published: 8-Jun-2000; LatestRevisionDate: 17-Dec-2003; LatestRevisionNote: PCB Footprint replaced.; DatasheetDocument: 16-Apr-2002; PackageDocument: 16-Apr-2002; PackageReference: 3.5X2.8X1.9; Publisher: Altium Limited

## Sheet current_sensor.SchDoc
size A
Used 3 times, as channels current_sensor_cells, current_sensor_ax, current_sensor_pack. Parts and nets are listed once, with the designators drawn on the sheet.
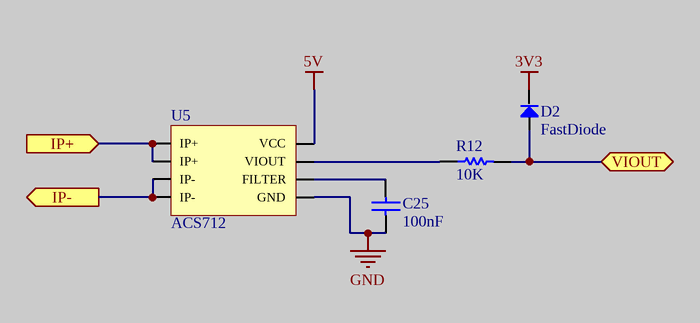
[diagram p4: current_sensor.SchDoc]

### Parts
C25  100nF  [CAPC0603]
D2  FastDiode  [FastDiode]
R12  10K  [RESC0603]
U5  ACS712  [ACS712]

### Ports
IP+ (in), IP- (out), VIOUT (bidir)

### Nets
3V3: D2.2(K)
5V: U5.8(VCC)
GND: C25.1 U5.5(GND)
IP+: U5.1(IP+) U5.2(IP+) ; port IP+
IP-: U5.3(IP-) U5.4(IP-) ; port IP-
VIOUT: D2.1(A) R12.2 ; port VIOUT
NetC25_2: C25.2 U5.6(FILTER)
NetR12_1: R12.1 U5.7(VIOUT)

### Channels
current_sensor_cells: designators C25=C25A D2=D2A#1 R12=R12A U5=U5A; ports IP+=M2_pos IP-=M2_pos_sensed VIOUT=CurrentSensor_cells
current_sensor_ax: designators C25=C28A D2=D2B#1 R12=R12B U5=U6A#1; ports IP+=NetD6_2 IP-=NetQ4N_2 VIOUT=CurrentSensor_AX
current_sensor_pack: designators C25=C28B D2=D2C#1 R12=R12C U5=U6B#1; ports IP+=M1_1 IP-=M1_1_cs VIOUT=CurrentSensor_pack

### Library data of the parts
C25 = Capacitor: Published: 8-Jun-2000; LatestRevisionDate: 17-Jul-2002; LatestRevisionNote: Re-released for DXP Platform.; PackageReference: C0805; Publisher: Altium Limited; Value: 100nF
R12 = Resistor: 0603,0.1W; Published: 8-Jun-2000; LatestRevisionDate: 17-Jul-2002; LatestRevisionNote: Re-released for DXP Platform.; PackageReference: AXIAL-0.5; Publisher: Altium Limited; Value: 10K
U5 = ACS712: Sensing Current
D2 = FastDiode: Published: 8-Jun-2000; LatestRevisionDate: 17-Dec-2003; LatestRevisionNote: PCB Footprint replaced.; DatasheetDocument: 16-Apr-2002; PackageDocument: 16-Apr-2002; PackageReference: 3.5X2.8X1.9; Publisher: Altium Limited

## Sheet MCU.SchDoc
size A2
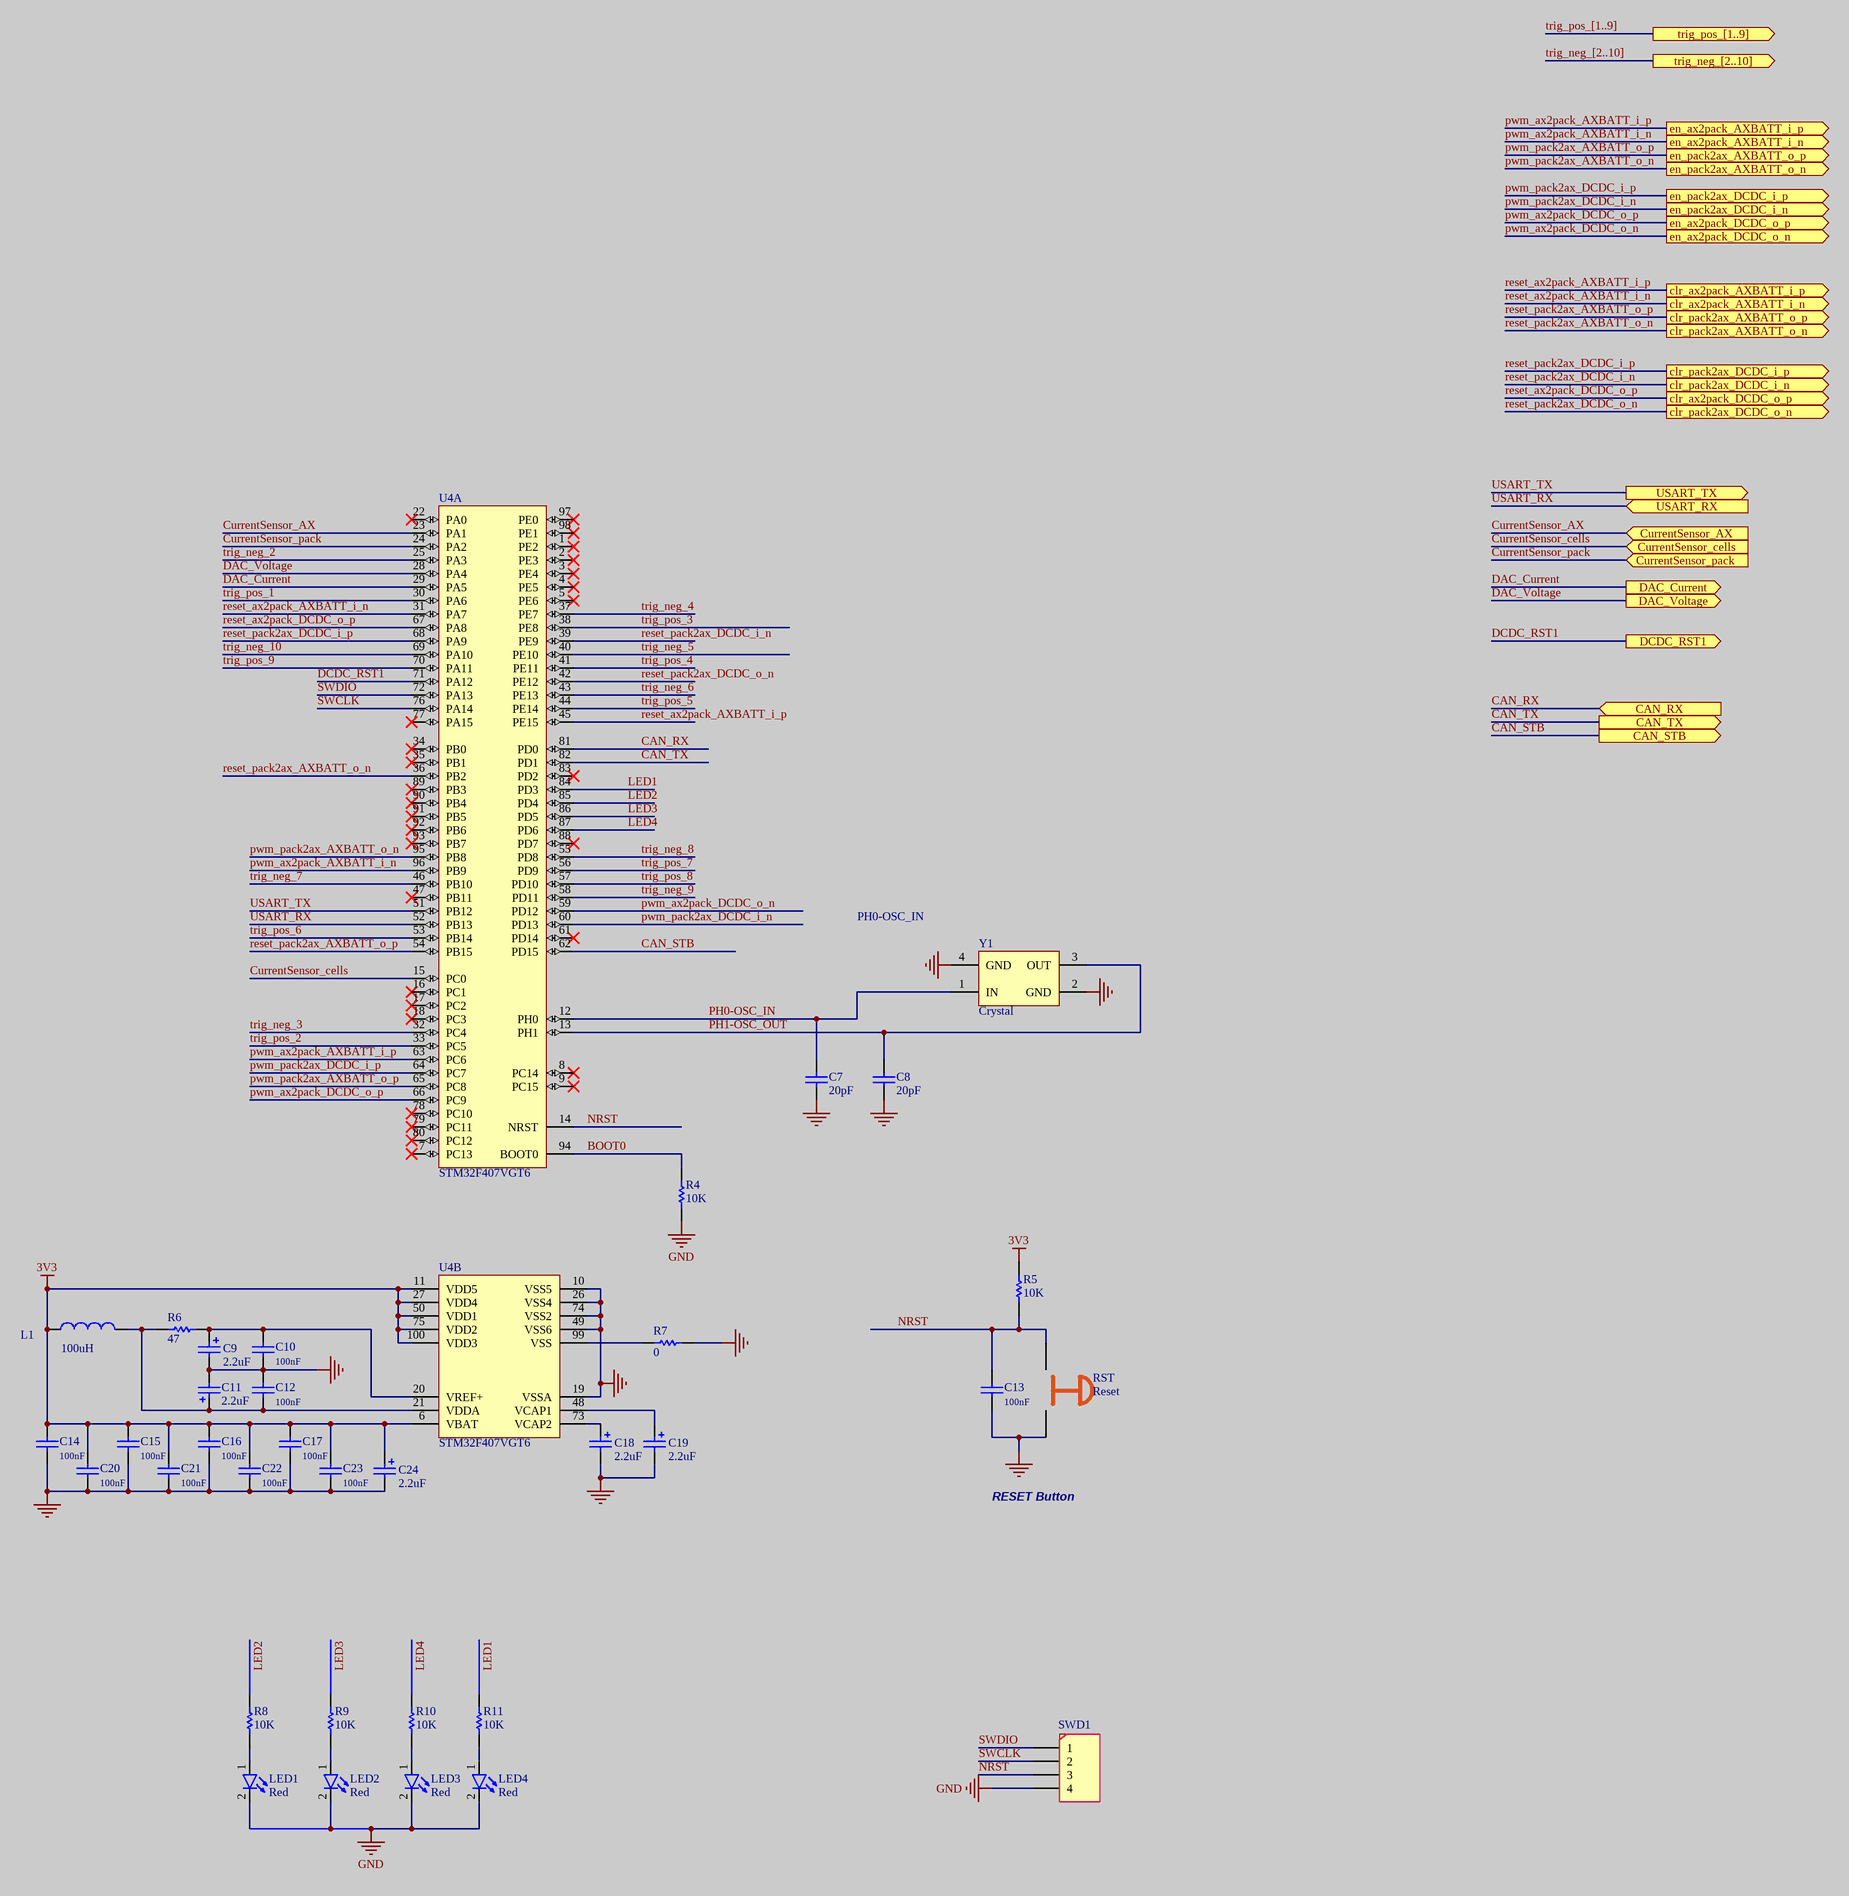
[diagram p5: MCU.SchDoc]

### Parts
C7  20pF  [CAPC0603]
C8  20pF  [CAPC0603]
C9  2.2uF  [C1206]
C10  100nF  [CAPC0603]
C11  2.2uF  [C1206]
C12  100nF  [CAPC0603]
C13  100nF  [CAPC0603]
C14  100nF  [CAPC0603]
C15  100nF  [CAPC0603]
C16  100nF  [CAPC0603]
C17  100nF  [CAPC0603]
C18  2.2uF  [C1206]
C19  2.2uF  [C1206]
C20  100nF  [CAPC0603]
C21  100nF  [CAPC0603]
C22  100nF  [CAPC0603]
C23  100nF  [CAPC0603]
C24  2.2uF  [C1206]
L1  100uH  [RES1206]
LED1  Red  [LED]
LED2  Red  [LED]
LED3  Red  [LED]
LED4  Red  [LED]
R4  10K  [RESC0603]
R5  10K  [RESC0603]
R6  47  [RESC0603]
R7  0  [RESC0603]
R8  10K  [RESC0603]
R9  10K  [RESC0603]
R10  10K  [RESC0603]
R11  10K  [RESC0603]
RST  Reset  [SWITCH-PB4]
SWD1  (no value)  [HEADER1*4]
U4  STM32F407VGT6  [QFP50P1600X1600X160-100N]  (parts A,B of 2)
Y1  Crystal  [ABM3B-8.000MHZ-B2]

### Ports
CAN_RX (in), CAN_STB (out), CAN_TX (out), clr_ax2pack_AXBATT_i_n (out), clr_ax2pack_AXBATT_i_p (out), clr_ax2pack_DCDC_o_p (out), clr_pack2ax_AXBATT_o_n (out), clr_pack2ax_AXBATT_o_p (out), clr_pack2ax_DCDC_i_n (out), clr_pack2ax_DCDC_i_p (out), clr_pack2ax_DCDC_o_n (out), CurrentSensor_AX (in), CurrentSensor_cells (in), CurrentSensor_pack (in), DAC_Current (out), DAC_Voltage (out), DCDC_RST1 (out), en_ax2pack_AXBATT_i_n (out), en_ax2pack_AXBATT_i_p (out), en_ax2pack_DCDC_o_n (out), en_ax2pack_DCDC_o_p (out), en_pack2ax_AXBATT_o_n (out), en_pack2ax_AXBATT_o_p (out), en_pack2ax_DCDC_i_n (out), en_pack2ax_DCDC_i_p (out), trig_neg_[2..10] (out), trig_pos_[1..9] (out), USART_RX (in), USART_TX (out)

### Nets
3V3: C14.1 C15.1 C16.1 C17.1 C20.1 C21.1 C22.1 C23.1 C24.1 L1.1 R5.2 U4.6(VBAT) U4.11(VDD5) U4.27(VDD4) U4.50(VDD1) U4.75(VDD2) U4.100(VDD3)
GND: C7.1 C8.1 C9.2 C10.2 C11.2 C12.1 C13.2 C14.2 C15.2 C16.2 C17.2 C18.2 C19.2 C20.2 C21.2 C22.2 C23.2 C24.2 LED1.2(K) LED2.2(K) LED3.2(K) LED4.2(K) R4.1 R7.1 RST.2 SWD1.4 U4.10(VSS5) U4.19(VSSA) U4.26(VSS4) U4.49(VSS6) U4.74(VSS2) Y1.2(GND) Y1.4(GND)
BOOT0: R4.2 U4.94(BOOT0)
CAN_RX: U4.81(PD0) ; port CAN_RX
CAN_STB: U4.62(PD15) ; port CAN_STB
CAN_TX: U4.82(PD1) ; port CAN_TX
CurrentSensor_AX: U4.23(PA1) ; port CurrentSensor_AX
CurrentSensor_cells: U4.15(PC0) ; port CurrentSensor_cells
CurrentSensor_pack: U4.24(PA2) ; port CurrentSensor_pack
DAC_Current: U4.29(PA5) ; port DAC_Current
DAC_Voltage: U4.28(PA4) ; port DAC_Voltage
DCDC_RST1: U4.71(PA12) ; port DCDC_RST1
LED1: R11.2 U4.84(PD3)
LED2: R8.2 U4.85(PD4)
LED3: R9.2 U4.86(PD5)
LED4: R10.2 U4.87(PD6)
NRST: C13.1 R5.1 RST.1 SWD1.3 U4.14(NRST)
PH0-OSC_IN: C7.2 U4.12(PH0) Y1.1(IN)
PH1-OSC_OUT: C8.2 U4.13(PH1) Y1.3(OUT)
pwm_ax2pack_AXBATT_i_n: U4.96(PB9) ; port en_ax2pack_AXBATT_i_n  [project net en_ax2pack_AXBATT_i_n]
pwm_ax2pack_AXBATT_i_p: U4.63(PC6) ; port en_ax2pack_AXBATT_i_p  [project net en_ax2pack_AXBATT_i_p]
pwm_ax2pack_DCDC_o_n: U4.59(PD12) ; port en_ax2pack_DCDC_o_n  [project net en_ax2pack_DCDC_o_n]
pwm_ax2pack_DCDC_o_p: U4.66(PC9) ; port en_ax2pack_DCDC_o_p  [project net en_ax2pack_DCDC_o_p]
pwm_pack2ax_AXBATT_o_n: U4.95(PB8) ; port en_pack2ax_AXBATT_o_n  [project net en_pack2ax_AXBATT_o_n]
pwm_pack2ax_AXBATT_o_p: U4.65(PC8) ; port en_pack2ax_AXBATT_o_p  [project net en_pack2ax_AXBATT_o_p]
pwm_pack2ax_DCDC_i_n: U4.60(PD13) ; port en_pack2ax_DCDC_i_n  [project net en_pack2ax_DCDC_i_n]
pwm_pack2ax_DCDC_i_p: U4.64(PC7) ; port en_pack2ax_DCDC_i_p  [project net en_pack2ax_DCDC_i_p]
reset_ax2pack_AXBATT_i_n: U4.31(PA7) ; port clr_ax2pack_AXBATT_i_n  [project net clr_ax2pack_AXBATT_i_n]
reset_ax2pack_AXBATT_i_p: U4.45(PE15) ; port clr_ax2pack_AXBATT_i_p  [project net clr_ax2pack_AXBATT_i_p]
reset_ax2pack_DCDC_o_p: U4.67(PA8) ; port clr_ax2pack_DCDC_o_p  [project net clr_ax2pack_DCDC_o_p]
reset_pack2ax_AXBATT_o_n: U4.36(PB2) ; port clr_pack2ax_AXBATT_o_n  [project net clr_pack2ax_AXBATT_o_n]
reset_pack2ax_AXBATT_o_p: U4.54(PB15) ; port clr_pack2ax_AXBATT_o_p  [project net clr_pack2ax_AXBATT_o_p]
reset_pack2ax_DCDC_i_n: U4.39(PE9) ; port clr_pack2ax_DCDC_i_n  [project net clr_pack2ax_DCDC_i_n]
reset_pack2ax_DCDC_i_p: U4.68(PA9) ; port clr_pack2ax_DCDC_i_p  [project net clr_pack2ax_DCDC_i_p]
reset_pack2ax_DCDC_o_n: U4.42(PE12) ; port clr_pack2ax_DCDC_o_n  [project net clr_pack2ax_DCDC_o_n]
SWCLK: SWD1.2 U4.76(PA14)
SWDIO: SWD1.1 U4.72(PA13)
trig_neg_2: U4.25(PA3)
trig_neg_3: U4.32(PC4)
trig_neg_4: U4.37(PE7)
trig_neg_5: U4.40(PE10)
trig_neg_6: U4.43(PE13)
trig_neg_7: U4.46(PB10)
trig_neg_8: U4.55(PD8)
trig_neg_9: U4.58(PD11)
trig_neg_10: U4.69(PA10)
trig_pos_1: U4.30(PA6)
trig_pos_2: U4.33(PC5)
trig_pos_3: U4.38(PE8)
trig_pos_4: U4.41(PE11)
trig_pos_5: U4.44(PE14)
trig_pos_6: U4.53(PB14)
trig_pos_7: U4.56(PD9)
trig_pos_8: U4.57(PD10)
trig_pos_9: U4.70(PA11)
USART_RX: U4.52(PB13) ; port USART_RX
USART_TX: U4.51(PB12) ; port USART_TX
NetC9_1: C9.1 C10.1 R6.1 U4.20(VREF+)
NetC11_1: C11.1 C12.2 L1.2 R6.2 U4.21(VDDA)
NetC18_1: C18.1 U4.73(VCAP2)
NetC19_1: C19.1 U4.48(VCAP1)
NetLED1_1: LED1.1(A) R8.1
NetLED2_1: LED2.1(A) R9.1
NetLED3_1: LED3.1(A) R10.1
NetLED4_1: LED4.1(A) R11.1
NetR7_2: R7.2 U4.99(VSS)

Not connected (* = marked no-connect by the designer): U4 1(PE2)* 2(PE3)* 3(PE4)* 4(PE5)* 5(PE6)* 7(PC13)* 8(PC14)* 9(PC15)* 16(PC1)* 17(PC2)* 18(PC3)* 22(PA0)* 34(PB0)* 35(PB1)* 47(PB11)* 61(PD14)* 77(PA15)* 78(PC10)* 79(PC11)* 80(PC12)* 83(PD2)* 88(PD7)* 89(PB3)* 90(PB4)* 91(PB5)* 92(PB6)* 93(PB7)* 97(PE0)* 98(PE1)*

### Buses and harness runs
bus trig_neg_[2..10] = port trig_neg_[2..10]
bus trig_pos_[1..9] = port trig_pos_[1..9]

### Notes on the sheet
- PH0-OSC_IN
- RESET Button

### Library data of the parts
C7 C8 C10 C12-C17 C20-C23 = Capacitor: Published: 8-Jun-2000; LatestRevisionDate: 17-Jul-2002; LatestRevisionNote: Re-released for DXP Platform.; PackageReference: C0805; Publisher: Altium Limited
  C7 C8: Value: 20pF
  C10 C12-C17 C20-C23: Value: 100nF
C9 C11 C18 C19 C24 = Cap_Tan: Tantalium Capacitor Size C; Published: 8-Jun-2000; LatestRevisionDate: 17-Jul-2002; LatestRevisionNote: Re-released for DXP Platform.; PackageReference: C0805; Publisher: Altium Limited
L1 = INDUCTOR: Value: 68uH; Code_IEC: 1005; Published: 8-Jun-2000; Publisher: Altium Limited; LatestRevisionDate: 17-Jul-2002; LatestRevisionNote: Re-released for DXP Platform.; PackageReference: 0402-A; Code_JEITA: 0402
LED1-LED4 = LED: Designer: Saeid Jorablo; Organazation: ControTec; Adding Date: 1387/12/22; Color: Red; Size: SMD 0603
R4-R11 = Resistor: 0603,0.1W; Published: 8-Jun-2000; LatestRevisionDate: 17-Jul-2002; LatestRevisionNote: Re-released for DXP Platform.; PackageReference: AXIAL-0.5; Publisher: Altium Limited
  R4 R5 R8-R11: Value: 10K
  R6: Value: 47
  R7: Value: 0
RST = Swtich-PB4: 4-Pin Push Button
SWD1 = Header1*4: Header, 4-Pin
U4 = STM32H743: STM32 Manta (STM32F407VGT6); Manuf_1: STM; Provided: ST; Ref St: 9175122; ECCN_US/EU: 3A991A2/NEC; Manuf_Part_1: STM32F407VGT6; Distrib: ST; Footprint: QFP100
Y1 = Crystal: ABM3B-8.000MHZ-B2

## Sheet DCDC.SchDoc
size A
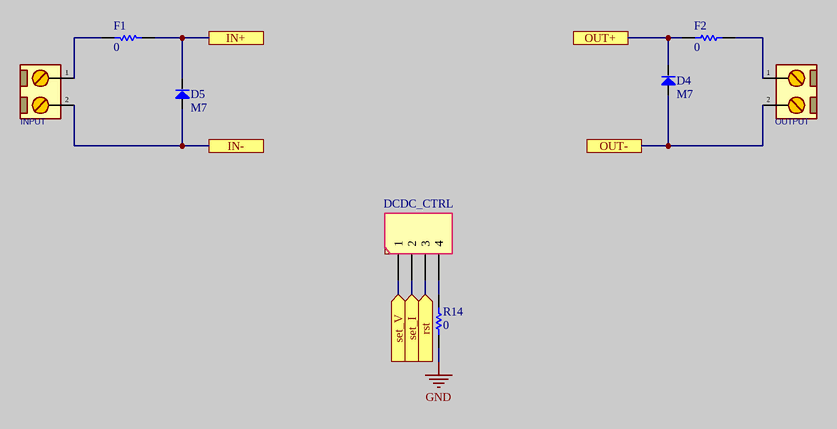
[diagram p6: DCDC.SchDoc]

### Parts
D4  M7  [FastDiode]
D5  M7  [FastDiode]
DCDC_CTRL  Header1*4  [HEADER1*4]  (value not drawn)
F1  0  [RES1206]
F2  0  [RES1206]
INPUT  CONN_TB8  [terminal block - 2828372]  (value not drawn)
OUTPUT  CONN_TB8  [terminal block - 2828372]  (value not drawn)
R14  0  [RESC0603]

### Ports
IN+, IN-, OUT+, OUT-, rst (in), set_I (in), set_V (in)

### Nets
GND: D5.1(A) INPUT.2 R14.1 ; port IN-
DAC_Current: DCDC_CTRL.2 ; port set_I
DAC_Voltage: DCDC_CTRL.1 ; port set_V
DCDC_RST1: DCDC_CTRL.3 ; port rst
NetD4_1: D4.1(A) OUTPUT.2 ; port OUT-
NetD4_2: D4.2(K) F2.1 ; port OUT+
NetD5_2: D5.2(K) F1.1 ; port IN+
NetDCDC_CTRL_4: DCDC_CTRL.4 R14.2
NetF1_2: F1.2 INPUT.1
NetF2_2: F2.2 OUTPUT.1

### Library data of the parts
D4 D5 = FastDiode: Published: 8-Jun-2000; LatestRevisionDate: 17-Dec-2003; LatestRevisionNote: PCB Footprint replaced.; DatasheetDocument: 16-Apr-2002; PackageDocument: 16-Apr-2002; PackageReference: 3.5X2.8X1.9; Publisher: Altium Limited
DCDC_CTRL = Header1*4: Header, 4-Pin
F1 F2 R14 = Resistor: 0603,0.1W; Published: 8-Jun-2000; LatestRevisionDate: 17-Jul-2002; LatestRevisionNote: Re-released for DXP Platform.; PackageReference: AXIAL-0.5; Publisher: Altium Limited; Value: 0
INPUT OUTPUT = TERMINAL_BLOCK 1 × 2: CONN, TERMINAL BLOCK, 5.08mm pitch; VALUE: CONN_TB8

## Sheet communication.SchDoc
size A4
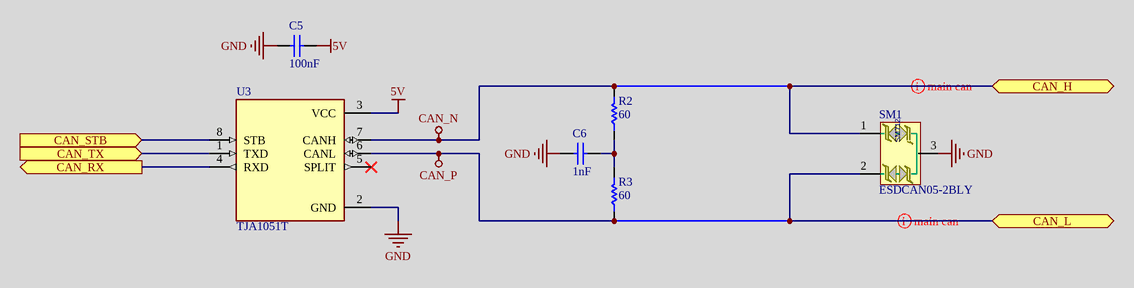
[diagram p7: communication.SchDoc]

### Parts
C5  100nF  [CAPC0603]
C6  1nF  [CAPC0603]
R2  60  [RESC0603]
R3  60  [RESC0603]
SM1  ESDCAN05-2BLY  [SOT-23_N]
U3  TJA1051T  [LM358]

### Ports
CAN_H (bidir), CAN_L (bidir), CAN_RX (out), CAN_STB (in), CAN_TX (in)

### Nets
5V: C5.1 U3.3(VCC)
CAN_N: R2.2 SM1.1 U3.7(CANH) ; port CAN_H
CAN_P: R3.1 SM1.2 U3.6(CANL) ; port CAN_L
GND: C5.2 C6.2 SM1.3 U3.2(GND)
CAN_RX: U3.4(RXD) ; port CAN_RX
CAN_STB: U3.8(STB) ; port CAN_STB
CAN_TX: U3.1(TXD) ; port CAN_TX
NetC6_1: C6.1 R2.1 R3.2

Not connected (* = marked no-connect by the designer): U3 5(SPLIT)*

### Layout directives
differential pair: CAN_N, CAN_P

### Library data of the parts
C5 C6 = Cap: Capacitor; Published: 8-Jun-2000; LatestRevisionDate: 17-Jul-2002; LatestRevisionNote: Re-released for DXP Platform.; PackageReference: RAD-0.3; Publisher: Altium Limited; PackageDescription: Radial Cap, Thru-Hole; 2 Leads; 0.3 in Pin Spacing
  C5: Value: 100nF
  C6: Value: 1nF
R2 R3 = Resistor: Tolerance: 5%; Power: 1/8 W; Value: 60
SM1 = SM712: Asymmetrical TVS Diode for Extended Common-Mode RS-485
U3 = TJA1040: 1/1 Transceiver Half CANbus 8-SO; MF: NXP USA; Package: SOIC-8 NXP USA; SnapEDA_Link: https://www.snapeda.com/parts/TJA1040/NXP%20USA%20Inc./view-part/563351/?ref=snap; Price: None; Availability: Unavailable; MP: TJA1040; Value: *

## Sheet power.SchDoc
size A
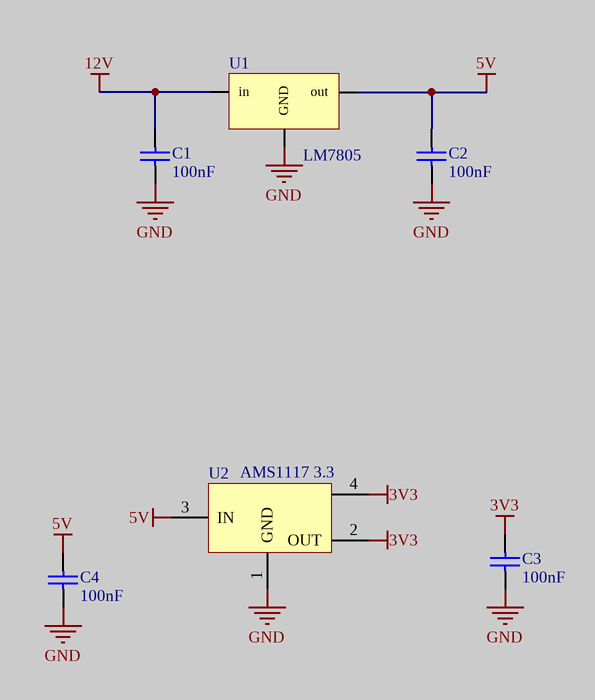
[diagram p8: power.SchDoc]

### Parts
C1  100nF  [CAPC0603]
C2  100nF  [CAPC0603]
C3  100nF  [CAPC0603]
C4  100nF  [CAPC0603]
U1  LM7805  [D2PAK]
U2  AMS1117 3.3  [AMS1117]

### Nets
3V3: C3.2 U2.2(OUT) U2.4
5V: C2.2 C4.2 U1.3(out) U2.3(IN)
12V: C1.2 U1.1(in)
GND: C1.1 C2.1 C3.1 C4.1 U1.2(GND) U2.1(GND)

### Library data of the parts
C1-C4 = Capacitor: Published: 8-Jun-2000; LatestRevisionDate: 17-Jul-2002; LatestRevisionNote: Re-released for DXP Platform.; PackageReference: C0805; Publisher: Altium Limited; Value: 100nF
U1 = LM7805: IC REG LIN 5V 1A
U2 = AMS1117

## Sheet bidirectional_switch_N.SchDoc
size A
Used 20 times, as channels bidirectional_switch_pos_N4, bidirectional_switch_pos_N5, bidirectional_switch_pos_N6, bidirectional_switch_pos_N7, bidirectional_switch_pos_N8, bidirectional_switch_pos_N9, bidirectional_switch_neg_N5, bidirectional_switch_neg_N6, bidirectional_switch_neg_N7, bidirectional_switch_neg_N8, bidirectional_switch_neg_N9, bidirectional_switch_neg_N10, bidirectional_switch_pos_DCDC_o, bidirectional_switch_pos_AXBATT_i, bidirectional_switch_pos_DCDC_i, bidirectional_switch_pos_AXBATT_o, bidirectional_switch_neg_DCDC_o, bidirectional_switch_neg_DCDC_i, bidirectional_switch_neg_AXBATT_o, bidirectional_switch_neg_AXBATT_i. Parts and nets are listed once, with the designators drawn on the sheet.
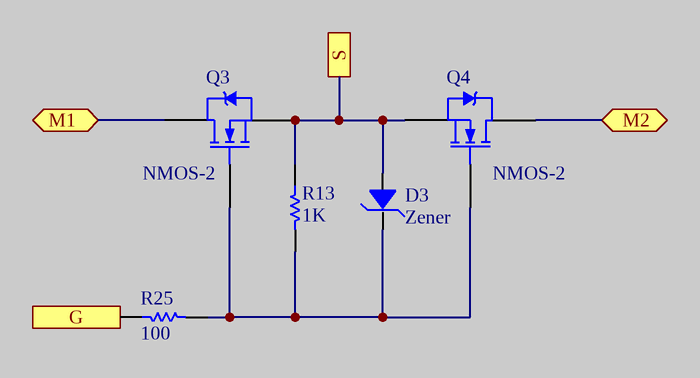
[diagram p9: bidirectional_switch_N.SchDoc]

### Parts
D3  Zener  [ZENER]
Q3  NMOS-2  [dpak]
Q4  NMOS-2  [dpak]
R13  1K  [RESC0603]
R25  100  [RESC0603]

### Ports
G (in), M1 (bidir), M2 (bidir), S

### Nets
G: R25.1 ; port G
M1: Q3.2(D) ; port M1
M2: Q4.2(D) ; port M2
S: D3.1(A) Q3.3(S) Q4.3(S) R13.1 ; port S
NetD3_2: D3.2(K) Q3.1(G) Q4.1(G) R13.2 R25.2

### Channels
bidirectional_switch_pos_N4: designators end in A; ports G=NetR25A_1 M1=NetF6_2 M2=M2_pos S=NetD3A_1
bidirectional_switch_pos_N5: designators end in B; ports G=NetR25B_1 M1=NetF7_2 M2=M2_pos S=NetD3B_1
bidirectional_switch_pos_N6: designators end in C; ports G=NetR25C_1 M1=NetF8_2 M2=M2_pos S=NetD3C_1
bidirectional_switch_pos_N7: designators end in D; ports G=NetR25D_1 M1=NetF9_2 M2=M2_pos S=NetD3D_1
bidirectional_switch_pos_N8: designators end in E; ports G=NetR25E_1 M1=NetF10_2 M2=M2_pos S=NetD3E_1
bidirectional_switch_pos_N9: designators end in F; ports G=NetR25F_1 M1=NetF11_2 M2=M2_pos S=NetD3F_1
bidirectional_switch_neg_N5: designators end in G; ports G=NetR25G_1 M1=M1_5 M2=M2_neg S=NetD3G_1
bidirectional_switch_neg_N6: designators end in H; ports G=NetR25H_1 M1=M1_6 M2=M2_neg S=NetD3H_1
bidirectional_switch_neg_N7: designators end in I; ports G=NetR25I_1 M1=M1_7 M2=M2_neg S=NetD3I_1
bidirectional_switch_neg_N8: designators D3=D2A#2 Q3=Q3J Q4=Q4J R13=R19A#1 R25=R25J; ports G=NetR25J_1 M1=M1_8 M2=M2_neg S=NetD2A#2_1
bidirectional_switch_neg_N9: designators D3=D2B#2 Q3=Q3K Q4=Q4K R13=R19B#1 R25=R25K; ports G=NetR25K_1 M1=M1_9 M2=M2_neg S=NetD2B#2_1
bidirectional_switch_neg_N10: designators D3=D2C#2 Q3=Q3L Q4=Q4L R13=R19C#1 R25=R25L; ports G=NetR25L_1 M1=M1_10 M2=M2_neg S=NetD2C#2_1
bidirectional_switch_pos_DCDC_o: designators end in M; ports G=NetR20H_1 M1=M2_pos_sensed M2=NetD4_2 S=NetD3M_1
bidirectional_switch_pos_AXBATT_i: designators end in N; ports G=NetR20A_1 M1=NetD5_2 M2=NetQ4N_2 S=NetD3N_1
bidirectional_switch_pos_DCDC_i: designators end in O; ports G=NetR20B_1 M1=M2_pos_sensed M2=NetD5_2 S=NetD3O_1
bidirectional_switch_pos_AXBATT_o: designators end in P; ports G=NetR20C_1 M1=NetD4_2 M2=NetQ4N_2 S=NetD3P_1
bidirectional_switch_neg_DCDC_o: designators end in Q; ports G=NetR20D_1 M1=M2_neg M2=NetD4_1 S=NetD3Q_1
bidirectional_switch_neg_DCDC_i: designators end in R; ports G=NetR20E_1 M1=M2_neg M2=GND S=NetD3R_1
bidirectional_switch_neg_AXBATT_o: designators end in S; ports G=NetR20F_1 M1=NetD4_1 M2=NetAXBATT_2 S=NetD3S_1
bidirectional_switch_neg_AXBATT_i: designators end in T; ports G=NetR20G_1 M1=GND M2=NetAXBATT_2 S=NetD3T_1

### Library data of the parts
Q3 Q4 = NMOS-2: N-Channel Power MOSFET; Note: Pin 2 is electrically connected to pin 4.; Published: 8-Jun-2000; LatestRevisionDate: 17-Jul-2002; LatestRevisionNote: Re-released for DXP Platform.; DatasheetVersion: PD-9.814; PackageVersion: Feb-1997; PackageReference: TO-220AB; Publisher: Altium Limited; PackageDescription: TO, Thru-Hole, Vertical, Heatsink Mounted; 3 In-Line Leads; Pitch 2.54 mm; ComponentLink1Description: Manufacturer Link; ComponentLink1URL: http://www.irf.com/
R13 R25 = Resistor: 0603,0.1W; Published: 8-Jun-2000; LatestRevisionDate: 17-Jul-2002; LatestRevisionNote: Re-released for DXP Platform.; PackageReference: AXIAL-0.5; Publisher: Altium Limited
  R13: Value: 1K
  R25: Value: 100

## Sheet driver_isolated_opto.SchDoc
size A
Used 26 times, as channels driver_isolated_opto_pos_N4, driver_isolated_opto_pos_N5, driver_isolated_opto_pos_N6, driver_isolated_opto_pos_N7, driver_isolated_opto_pos_N8, driver_isolated_opto_pos_N9, driver_isolated_opto_neg_N5, driver_isolated_opto_neg_N6, driver_isolated_opto_neg_N7, driver_isolated_opto_neg_N8, driver_isolated_opto_neg_N9, driver_isolated_opto_neg_N10, driver_isolated_trans_pos_AXBATT_i/opto_off, driver_isolated_trans_pos_DCDC_i/opto_off, driver_isolated_trans_pos_AXBATT_o/opto_off, driver_isolated_opto_pos_N3, driver_isolated_opto_pos_N2, driver_isolated_opto_pos_N1, driver_isolated_opto_neg_N4, driver_isolated_opto_neg_N3, driver_isolated_opto_neg_N2, driver_isolated_trans_neg_DCDC_o/opto_off, driver_isolated_trans_neg_DCDC_i/opto_off, driver_isolated_trans_neg_AXBATT_o/opto_off, driver_isolated_trans_neg_AXBATT_i/opto_off, driver_isolated_trans_pos_DCDC_o/opto_off. Parts and nets are listed once, with the designators drawn on the sheet.
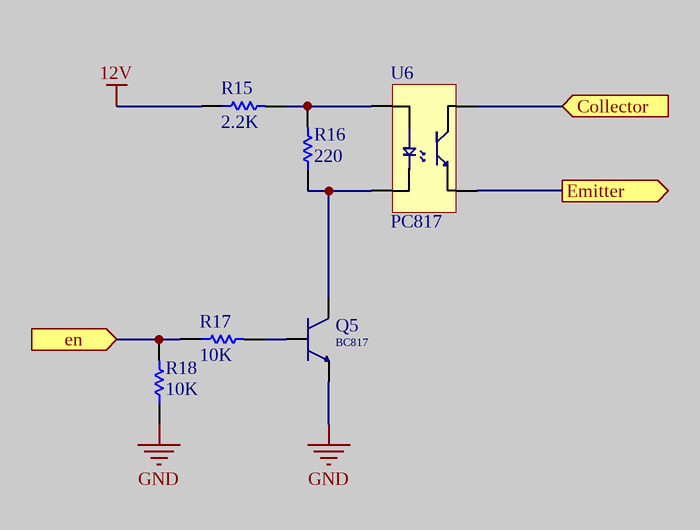
[diagram p10: driver_isolated_opto.SchDoc]

### Parts
Q5  NPN transistor  [NPN]  (value not drawn)
R15  2.2K  [RESC0603]
R16  220  [RESC0603]
R17  10K  [RESC0603]
R18  10K  [RESC0603]
U6  PC817  [PC817]

### Ports
Collector (in), Emitter (out), en (in)

### Nets
12V: R15.1
GND: Q5.2(E) R18.1
Collector: U6.4 ; port Collector
Emitter: U6.3 ; port Emitter
en: R17.1 R18.2 ; port en
NetQ5_1: Q5.1(B) R17.2
NetQ5_3: Q5.3(C) R16.1 U6.2
NetR15_2: R15.2 R16.2 U6.1

### Channels
driver_isolated_opto_pos_N4: designators Q5=Q5A R15=R15A R16=R16A R17=R17A R18=R18A U6=U6A#2; ports Collector=M1_1 Emitter=NetR25A_1 en=trig_pos_4
driver_isolated_opto_pos_N5: designators Q5=Q5B R15=R15B R16=R16B R17=R17B R18=R18B U6=U6B#2; ports Collector=M1_2 Emitter=NetR25B_1 en=trig_pos_5
driver_isolated_opto_pos_N6: designators end in C; ports Collector=M1_3 Emitter=NetR25C_1 en=trig_pos_6
driver_isolated_opto_pos_N7: designators end in D; ports Collector=M1_4 Emitter=NetR25D_1 en=trig_pos_7
driver_isolated_opto_pos_N8: designators end in E; ports Collector=M1_5 Emitter=NetR25E_1 en=trig_pos_8
driver_isolated_opto_pos_N9: designators end in F; ports Collector=M1_6 Emitter=NetR25F_1 en=trig_pos_9
driver_isolated_opto_neg_N5: designators end in G; ports Collector=M1_2 Emitter=NetR25G_1 en=trig_neg_5
driver_isolated_opto_neg_N6: designators end in H; ports Collector=M1_3 Emitter=NetR25H_1 en=trig_neg_6
driver_isolated_opto_neg_N7: designators end in I; ports Collector=M1_4 Emitter=NetR25I_1 en=trig_neg_7
driver_isolated_opto_neg_N8: designators end in J; ports Collector=M1_5 Emitter=NetR25J_1 en=trig_neg_8
driver_isolated_opto_neg_N9: designators end in K; ports Collector=M1_6 Emitter=NetR25K_1 en=trig_neg_9
driver_isolated_opto_neg_N10: designators end in L; ports Collector=M1_7 Emitter=NetR25L_1 en=trig_neg_10
driver_isolated_trans_pos_AXBATT_i/opto_off: designators end in M; ports Collector=NetD7A_2 Emitter=NetD3N_1 en=clr_ax2pack_AXBATT_i_p
driver_isolated_trans_pos_DCDC_i/opto_off: designators end in N; ports Collector=NetD7B_2 Emitter=NetD3O_1 en=clr_pack2ax_DCDC_i_p
driver_isolated_trans_pos_AXBATT_o/opto_off: designators end in O; ports Collector=NetD7C_2 Emitter=NetD3P_1 en=clr_pack2ax_AXBATT_o_p
driver_isolated_opto_pos_N3: designators end in P; ports Collector=NetR26C_1 Emitter=M1_6 en=trig_pos_3
driver_isolated_opto_pos_N2: designators end in Q; ports Collector=NetR26B_1 Emitter=M1_5 en=trig_pos_2
driver_isolated_opto_pos_N1: designators end in R; ports Collector=NetR26A_1 Emitter=M1_4 en=trig_pos_1
driver_isolated_opto_neg_N4: designators end in S; ports Collector=NetR26F_1 Emitter=M1_7 en=trig_neg_4
driver_isolated_opto_neg_N3: designators end in T; ports Collector=NetR26E_1 Emitter=M1_6 en=trig_neg_3
driver_isolated_opto_neg_N2: designators end in U; ports Collector=NetR26D_1 Emitter=M1_5 en=trig_neg_2
driver_isolated_trans_neg_DCDC_o/opto_off: designators end in V; ports Collector=NetD7D_2 Emitter=NetD3Q_1 en=clr_pack2ax_DCDC_o_n
driver_isolated_trans_neg_DCDC_i/opto_off: designators end in W; ports Collector=NetD7E_2 Emitter=NetD3R_1 en=clr_pack2ax_DCDC_i_n
driver_isolated_trans_neg_AXBATT_o/opto_off: designators end in X; ports Collector=NetD7F_2 Emitter=NetD3S_1 en=clr_pack2ax_AXBATT_o_n
driver_isolated_trans_neg_AXBATT_i/opto_off: designators end in Y; ports Collector=NetD7G_2 Emitter=NetD3T_1 en=clr_ax2pack_AXBATT_i_n
driver_isolated_trans_pos_DCDC_o/opto_off: designators end in Z; ports Collector=NetD7H_2 Emitter=NetD3M_1 en=clr_ax2pack_DCDC_o_p

### Library data of the parts
Q5 = BC817: 45 V, 0.5 A; Transistor: BC817
R15-R18 = Resistor: 0603,0.1W; Published: 8-Jun-2000; LatestRevisionDate: 17-Jul-2002; LatestRevisionNote: Re-released for DXP Platform.; PackageReference: AXIAL-0.5; Publisher: Altium Limited
  R15: Value: 2.2K
  R16: Value: 220
  R17 R18: Value: 10K
U6 = PC817: PC817 optocoupler

## Sheet driver_isolated_trans.SchDoc
size A
Used 8 times, as channels driver_isolated_trans_pos_AXBATT_i, driver_isolated_trans_pos_DCDC_i, driver_isolated_trans_pos_AXBATT_o, driver_isolated_trans_neg_DCDC_o, driver_isolated_trans_neg_DCDC_i, driver_isolated_trans_neg_AXBATT_o, driver_isolated_trans_neg_AXBATT_i, driver_isolated_trans_pos_DCDC_o. Parts and nets are listed once, with the designators drawn on the sheet.
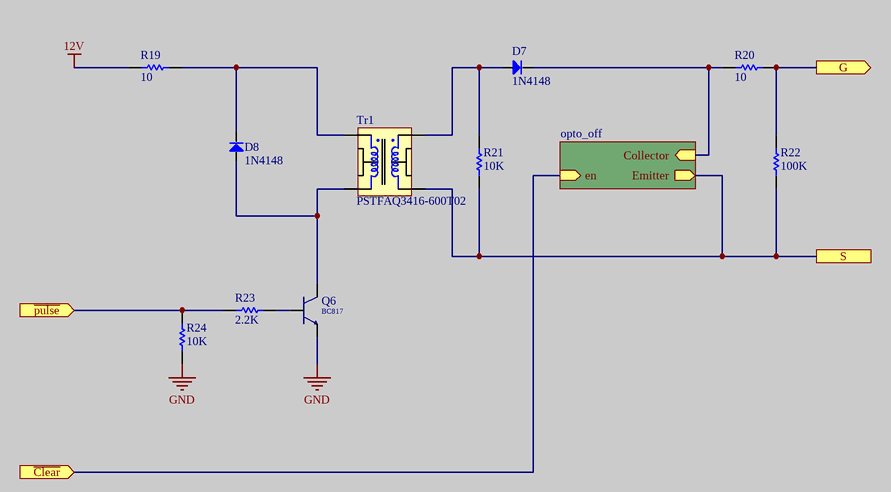
[diagram p11: driver_isolated_trans.SchDoc]

### Parts
D7  1N4148  [FastDiode]
D8  1N4148  [FastDiode]
Q6  NPN transistor  [NPN]  (value not drawn)
R19  10  [RESC0603]
R20  10  [RESC0603]
R21  10K  [RESC0603]
R22  100K  [RESC0603]
R23  2.2K  [RESC0603]
R24  10K  [RESC0603]
Tr1  PSTFAQ3416-600T02  [PSTFAQ3416-600T020]

### Sub-sheets
opto_off = driver_isolated_opto.SchDoc: en (in), Emitter (out), Collector (in)

### Ports
G (out), S, ~{Clear} (in), ~{pulse} (in)

### Nets
12V: R19.2
GND: Q6.2(E) R24.2
~{Clear}: port ~{Clear}, sheet opto_off/en
G: R20.1 R22.2 ; port G
~{pulse}: R23.2 R24.1 ; port ~{pulse}
S: R21.1 R22.1 Tr1.3 ; port S, sheet opto_off/Emitter
NetD7_1: D7.1(A) R21.2 Tr1.4
NetD7_2: D7.2(K) R20.2 ; sheet opto_off/Collector
NetD8_1: D8.1(A) Q6.3(C) Tr1.2
NetD8_2: D8.2(K) R19.1 Tr1.1
NetQ6_1: Q6.1(B) R23.1

### Channels
driver_isolated_trans_pos_AXBATT_i: designators D7=D7A D8=D8A Q6=Q6A R19=R19A#2 R20=R20A R21=R21A R22=R22A R23=R23A R24=R24A Tr1=Tr1A; ports G=NetR20A_1 S=NetD3N_1 ~{Clear}=clr_ax2pack_AXBATT_i_p ~{pulse}=en_ax2pack_AXBATT_i_p
driver_isolated_trans_pos_DCDC_i: designators D7=D7B D8=D8B Q6=Q6B R19=R19B#2 R20=R20B R21=R21B R22=R22B R23=R23B R24=R24B Tr1=Tr1B; ports G=NetR20B_1 S=NetD3O_1 ~{Clear}=clr_pack2ax_DCDC_i_p ~{pulse}=en_pack2ax_DCDC_i_p
driver_isolated_trans_pos_AXBATT_o: designators D7=D7C D8=D8C Q6=Q6C R19=R19C#2 R20=R20C R21=R21C R22=R22C R23=R23C R24=R24C Tr1=Tr1C; ports G=NetR20C_1 S=NetD3P_1 ~{Clear}=clr_pack2ax_AXBATT_o_p ~{pulse}=en_pack2ax_AXBATT_o_p
driver_isolated_trans_neg_DCDC_o: designators end in D; ports G=NetR20D_1 S=NetD3Q_1 ~{Clear}=clr_pack2ax_DCDC_o_n ~{pulse}=en_ax2pack_DCDC_o_n
driver_isolated_trans_neg_DCDC_i: designators end in E; ports G=NetR20E_1 S=NetD3R_1 ~{Clear}=clr_pack2ax_DCDC_i_n ~{pulse}=en_pack2ax_DCDC_i_n
driver_isolated_trans_neg_AXBATT_o: designators end in F; ports G=NetR20F_1 S=NetD3S_1 ~{Clear}=clr_pack2ax_AXBATT_o_n ~{pulse}=en_pack2ax_AXBATT_o_n
driver_isolated_trans_neg_AXBATT_i: designators end in G; ports G=NetR20G_1 S=NetD3T_1 ~{Clear}=clr_ax2pack_AXBATT_i_n ~{pulse}=en_ax2pack_AXBATT_i_n
driver_isolated_trans_pos_DCDC_o: designators end in H; ports G=NetR20H_1 S=NetD3M_1 ~{Clear}=clr_ax2pack_DCDC_o_p ~{pulse}=en_ax2pack_DCDC_o_p

### Library data of the parts
D7 D8 = FastDiode: Published: 8-Jun-2000; LatestRevisionDate: 17-Dec-2003; LatestRevisionNote: PCB Footprint replaced.; DatasheetDocument: 16-Apr-2002; PackageDocument: 16-Apr-2002; PackageReference: 3.5X2.8X1.9; Publisher: Altium Limited
Q6 = BC817: 45 V, 0.5 A; Transistor: BC817
R19-R24 = Resistor: 0603,0.1W; Published: 8-Jun-2000; LatestRevisionDate: 17-Jul-2002; LatestRevisionNote: Re-released for DXP Platform.; PackageReference: AXIAL-0.5; Publisher: Altium Limited
  R19 R20: Value: 10
  R21 R24: Value: 10K
  R22: Value: 100K
  R23: Value: 2.2K
Tr1 = transpulse small: MANF: OMRON; MANF_P#: G8QN-1C4 DC12; PARAM2: 16VDC, 30A; PARAM: 12V, 50mA; PRICE: PRICE; Value: PSTFAQ3416-600T02

## Sheet bidirectional_switch.SchDoc
size A
Used 6 times, as channels bidirectional_switch_pos_N1, bidirectional_switch_pos_N2, bidirectional_switch_pos_N3, bidirectional_switch_neg_N2, bidirectional_switch_neg_N3, bidirectional_switch_neg_N4. Parts and nets are listed once, with the designators drawn on the sheet.
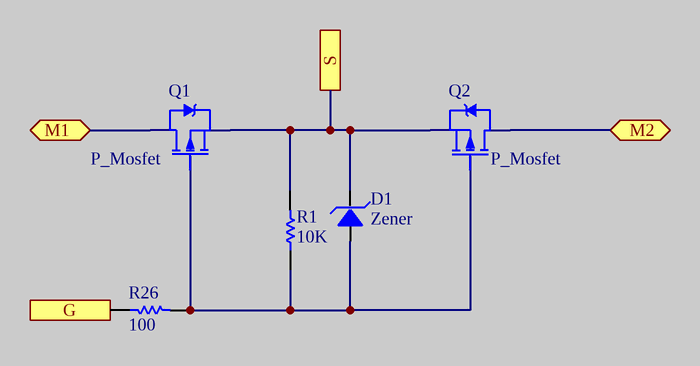
[diagram p12: bidirectional_switch.SchDoc]

### Parts
D1  Zener  [ZENER]
Q1  P_Mosfet  [dpak]
Q2  P_Mosfet  [dpak]
R1  10K  [RESC0603]
R26  100  [RESC0603]

### Ports
G (out), M1 (bidir), M2 (bidir), S

### Nets
G: R26.1 ; port G
M1: Q1.2(D) ; port M1
M2: Q2.2(D) ; port M2
S: D1.2(K) Q1.3(S) Q2.3(S) R1.2 ; port S
NetD1_1: D1.1(A) Q1.1(G) Q2.1(G) R1.1 R26.2

### Channels
bidirectional_switch_pos_N1: designators D1=D1S Q1=Q1A Q2=Q2A R1=R6S R26=R26A; ports G=NetR26A_1 M1=NetF3_2 M2=M2_pos S=NetD1S_2
bidirectional_switch_pos_N2: designators D1=D1R Q1=Q1B Q2=Q2B R1=R6R R26=R26B; ports G=NetR26B_1 M1=NetF4_2 M2=M2_pos S=NetD1R_2
bidirectional_switch_pos_N3: designators D1=D1Q Q1=Q1C Q2=Q2C R1=R6Q R26=R26C; ports G=NetR26C_1 M1=NetF5_2 M2=M2_pos S=NetD1Q_2
bidirectional_switch_neg_N2: designators D1=D1P Q1=Q1D Q2=Q2D R1=R6P R26=R26D; ports G=NetR26D_1 M1=M1_2 M2=M2_neg S=NetD1P_2
bidirectional_switch_neg_N3: designators D1=D1O Q1=Q1E Q2=Q2E R1=R6O R26=R26E; ports G=NetR26E_1 M1=M1_3 M2=M2_neg S=NetD1O_2
bidirectional_switch_neg_N4: designators D1=D1N Q1=Q1F Q2=Q2F R1=R6N R26=R26F; ports G=NetR26F_1 M1=M1_4 M2=M2_neg S=NetD1N_2

### Library data of the parts
Q1 Q2 = P_Mosfet IRF5305
R1 R26 = Resistor: 0603,0.1W; Published: 8-Jun-2000; LatestRevisionDate: 17-Jul-2002; LatestRevisionNote: Re-released for DXP Platform.; PackageReference: AXIAL-0.5; Publisher: Altium Limited
  R1: Value: 10K
  R26: Value: 100